# Altium schematic sheet PUMA-10S_V2.1.SchDoc: PUMA 10s (part 1 of 2)
size A0; Address2: PUMA technlogies; Address3: Tomsk; Address4: Russia; Revision: 2; PageSetup: Record=PageOptions|CenterHorizontal=True|CenterVertical=True|PrintScale=0.26|XCorrection=1.00|YCorrection=1.00|PrintKind=1|BorderSize=5000000|LeftOffset=0|BottomOffset=0|Orientation=2|PaperLength=8410|PaperWidth=11890|Scale=100|PaperSource=7|PrintQuality=720|MediaType=1|DitherType=10|PrintScaleMode=1|PaperKind=Custom Size|PaperIndex=256; ProjectName: PUMA 10s
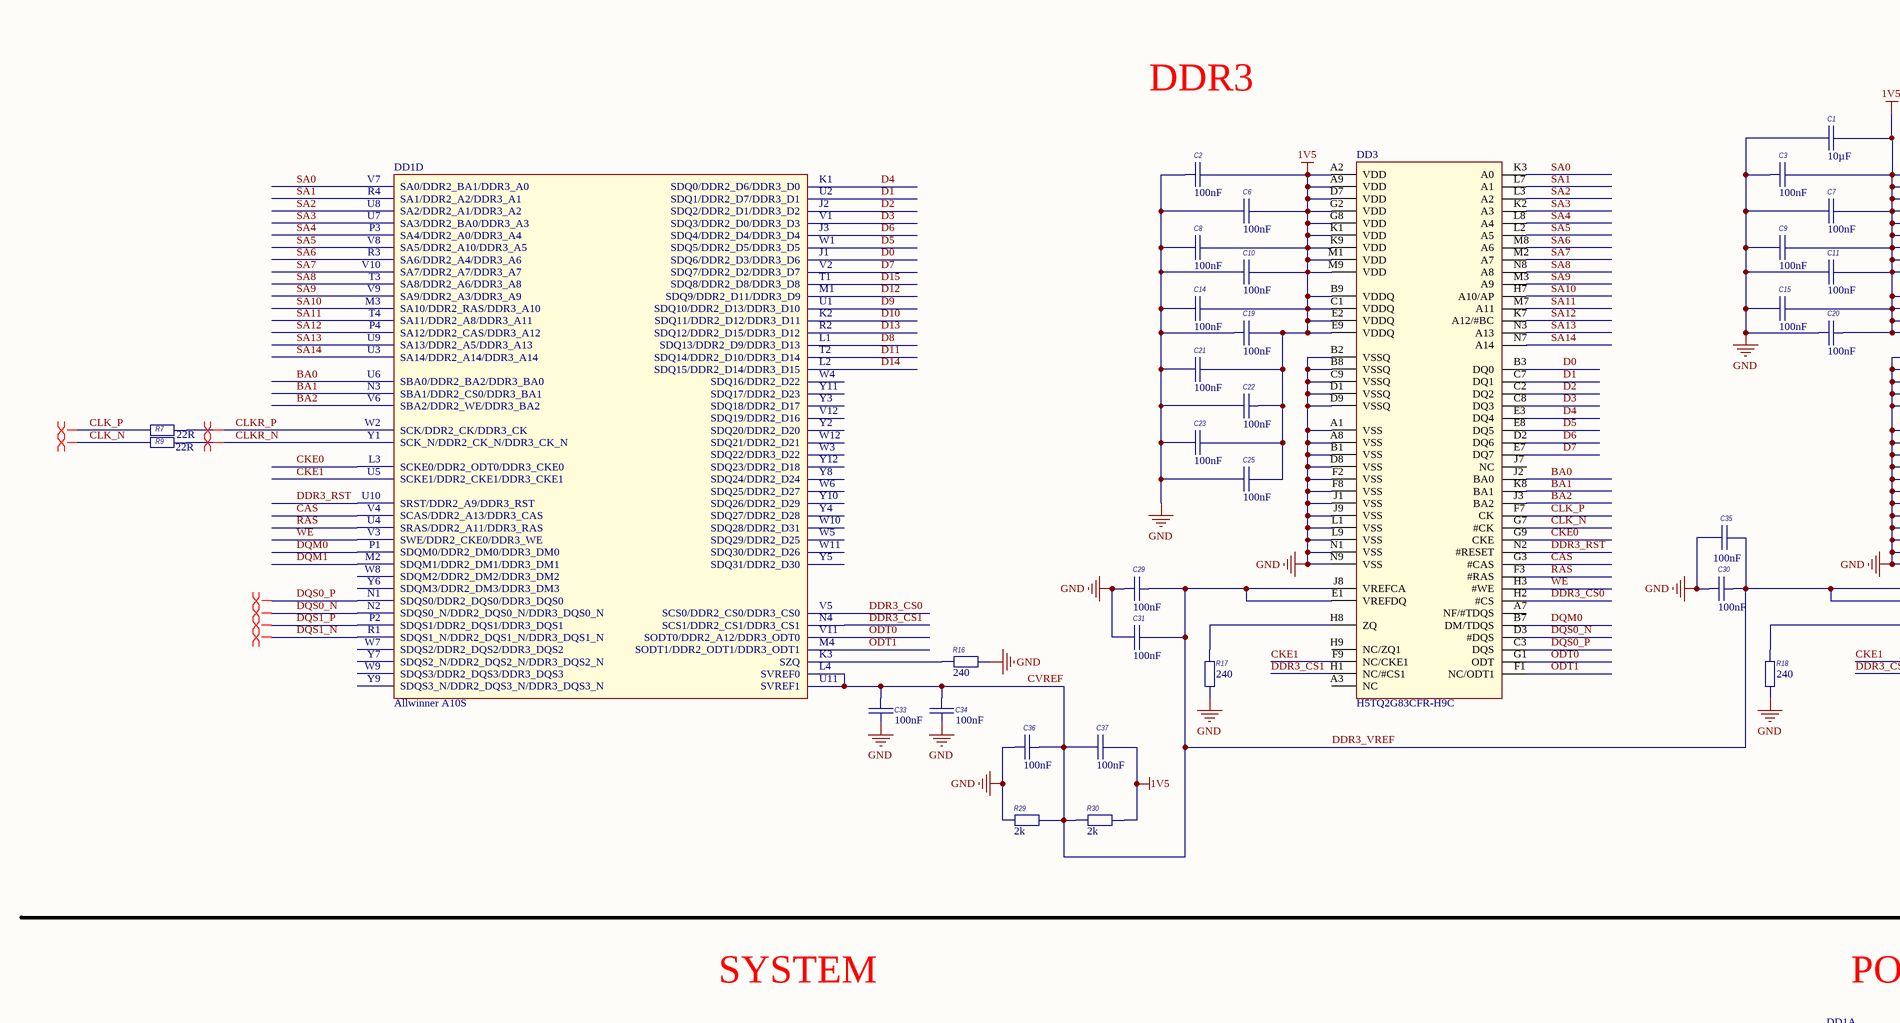
[diagram p0: PUMA-10S_V2.1.SchDoc, top left]
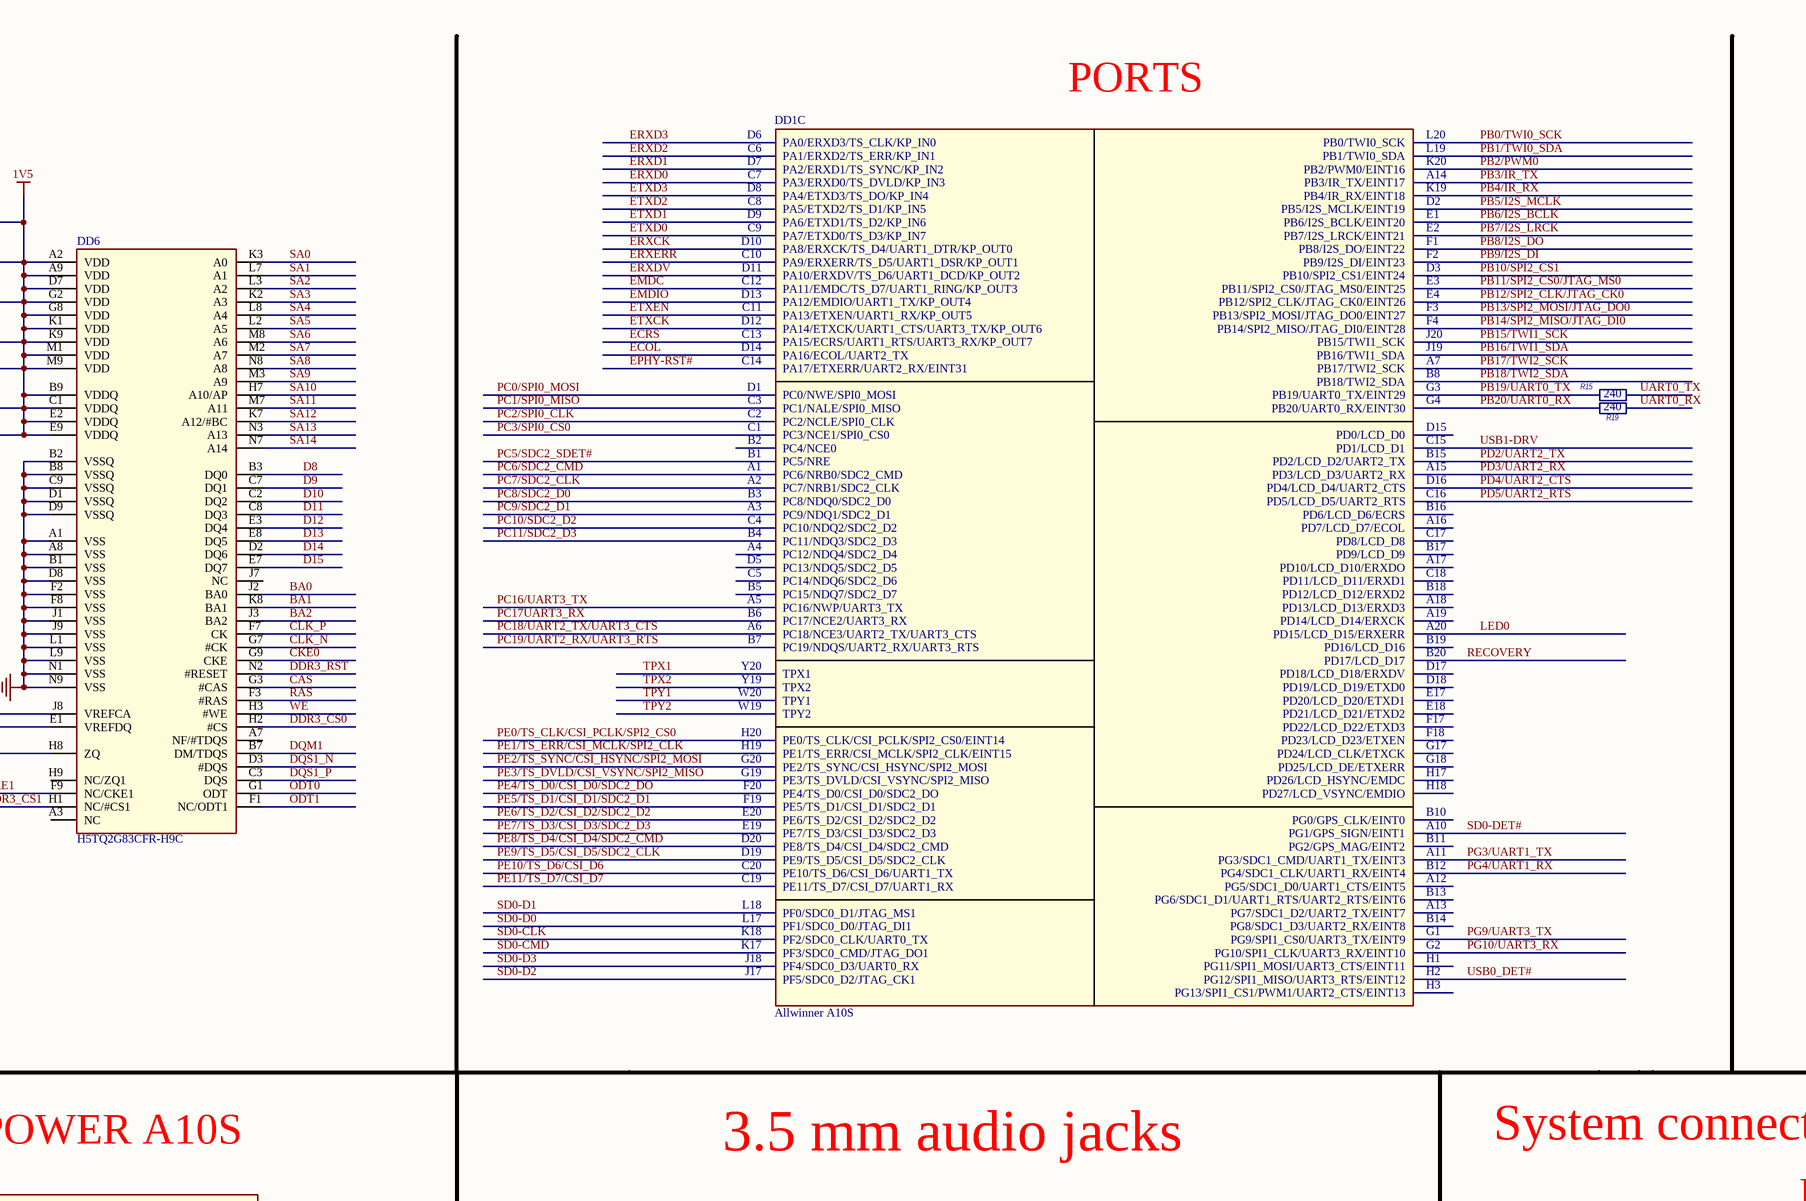
[diagram p1: PUMA-10S_V2.1.SchDoc, top middle]
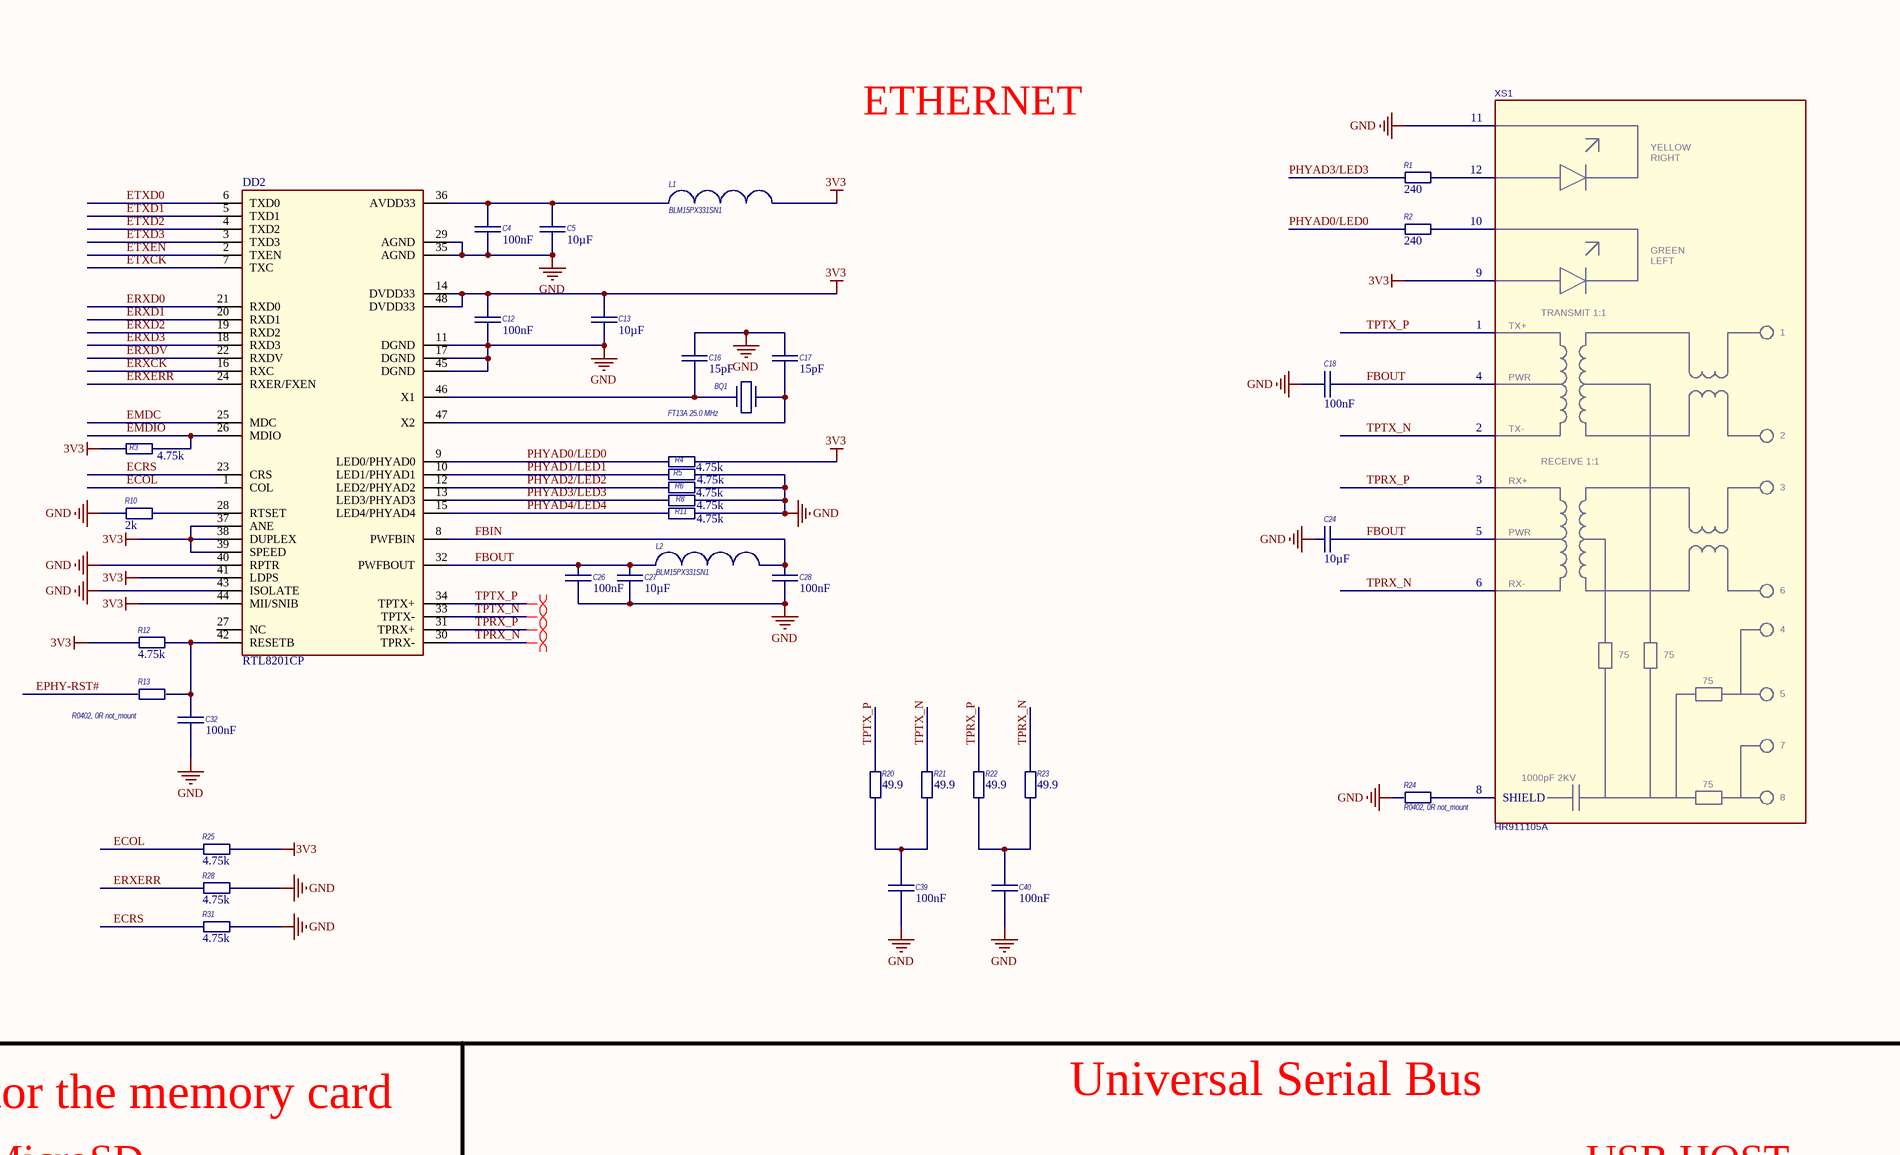
[diagram p2: PUMA-10S_V2.1.SchDoc, top right]
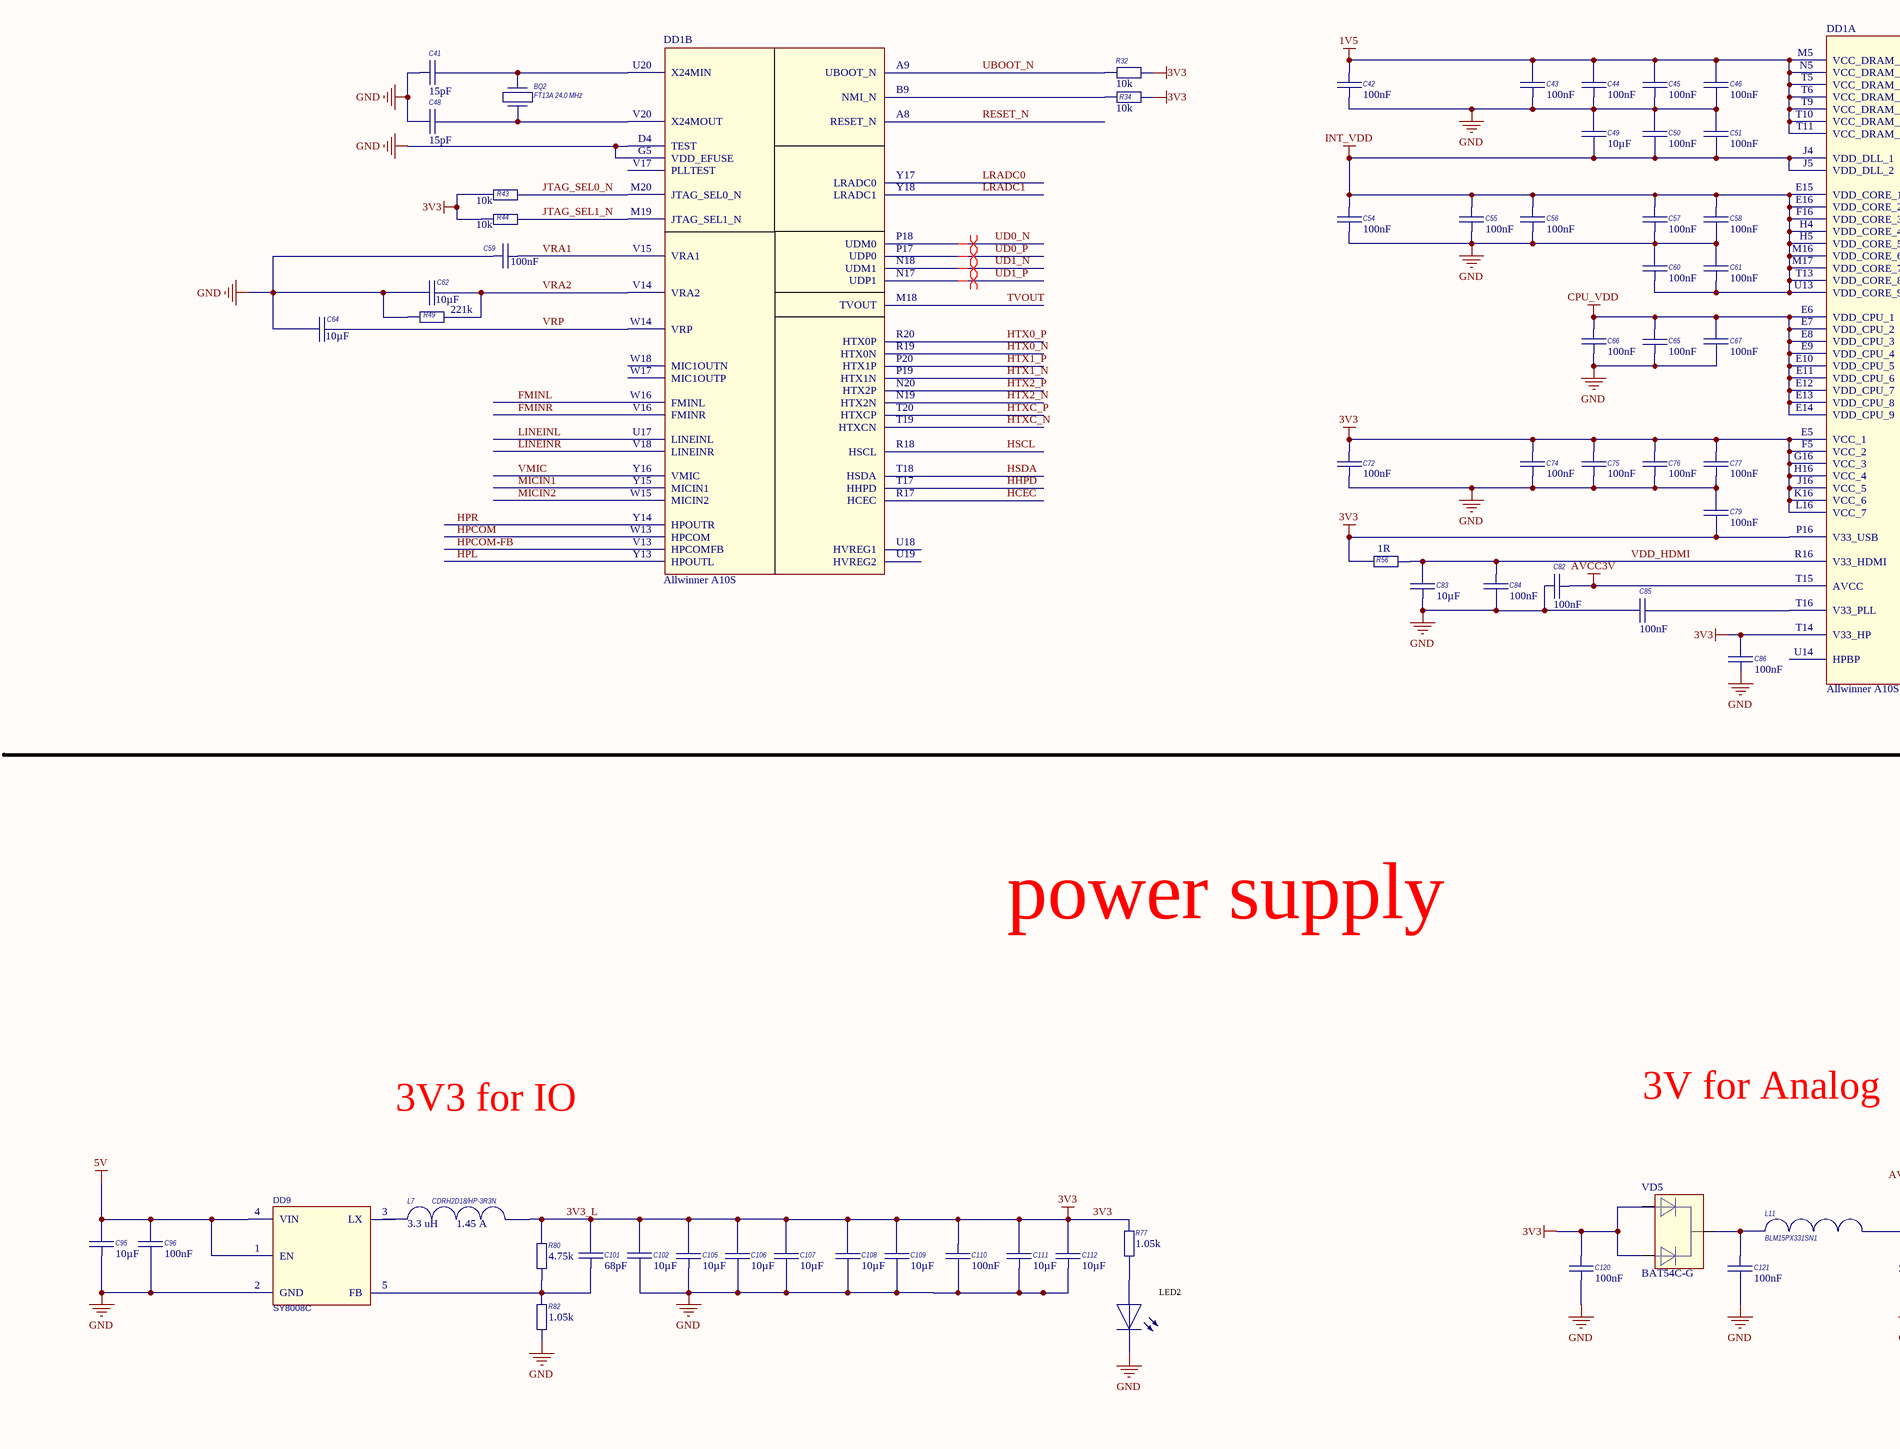
[diagram p3: PUMA-10S_V2.1.SchDoc, centre left]
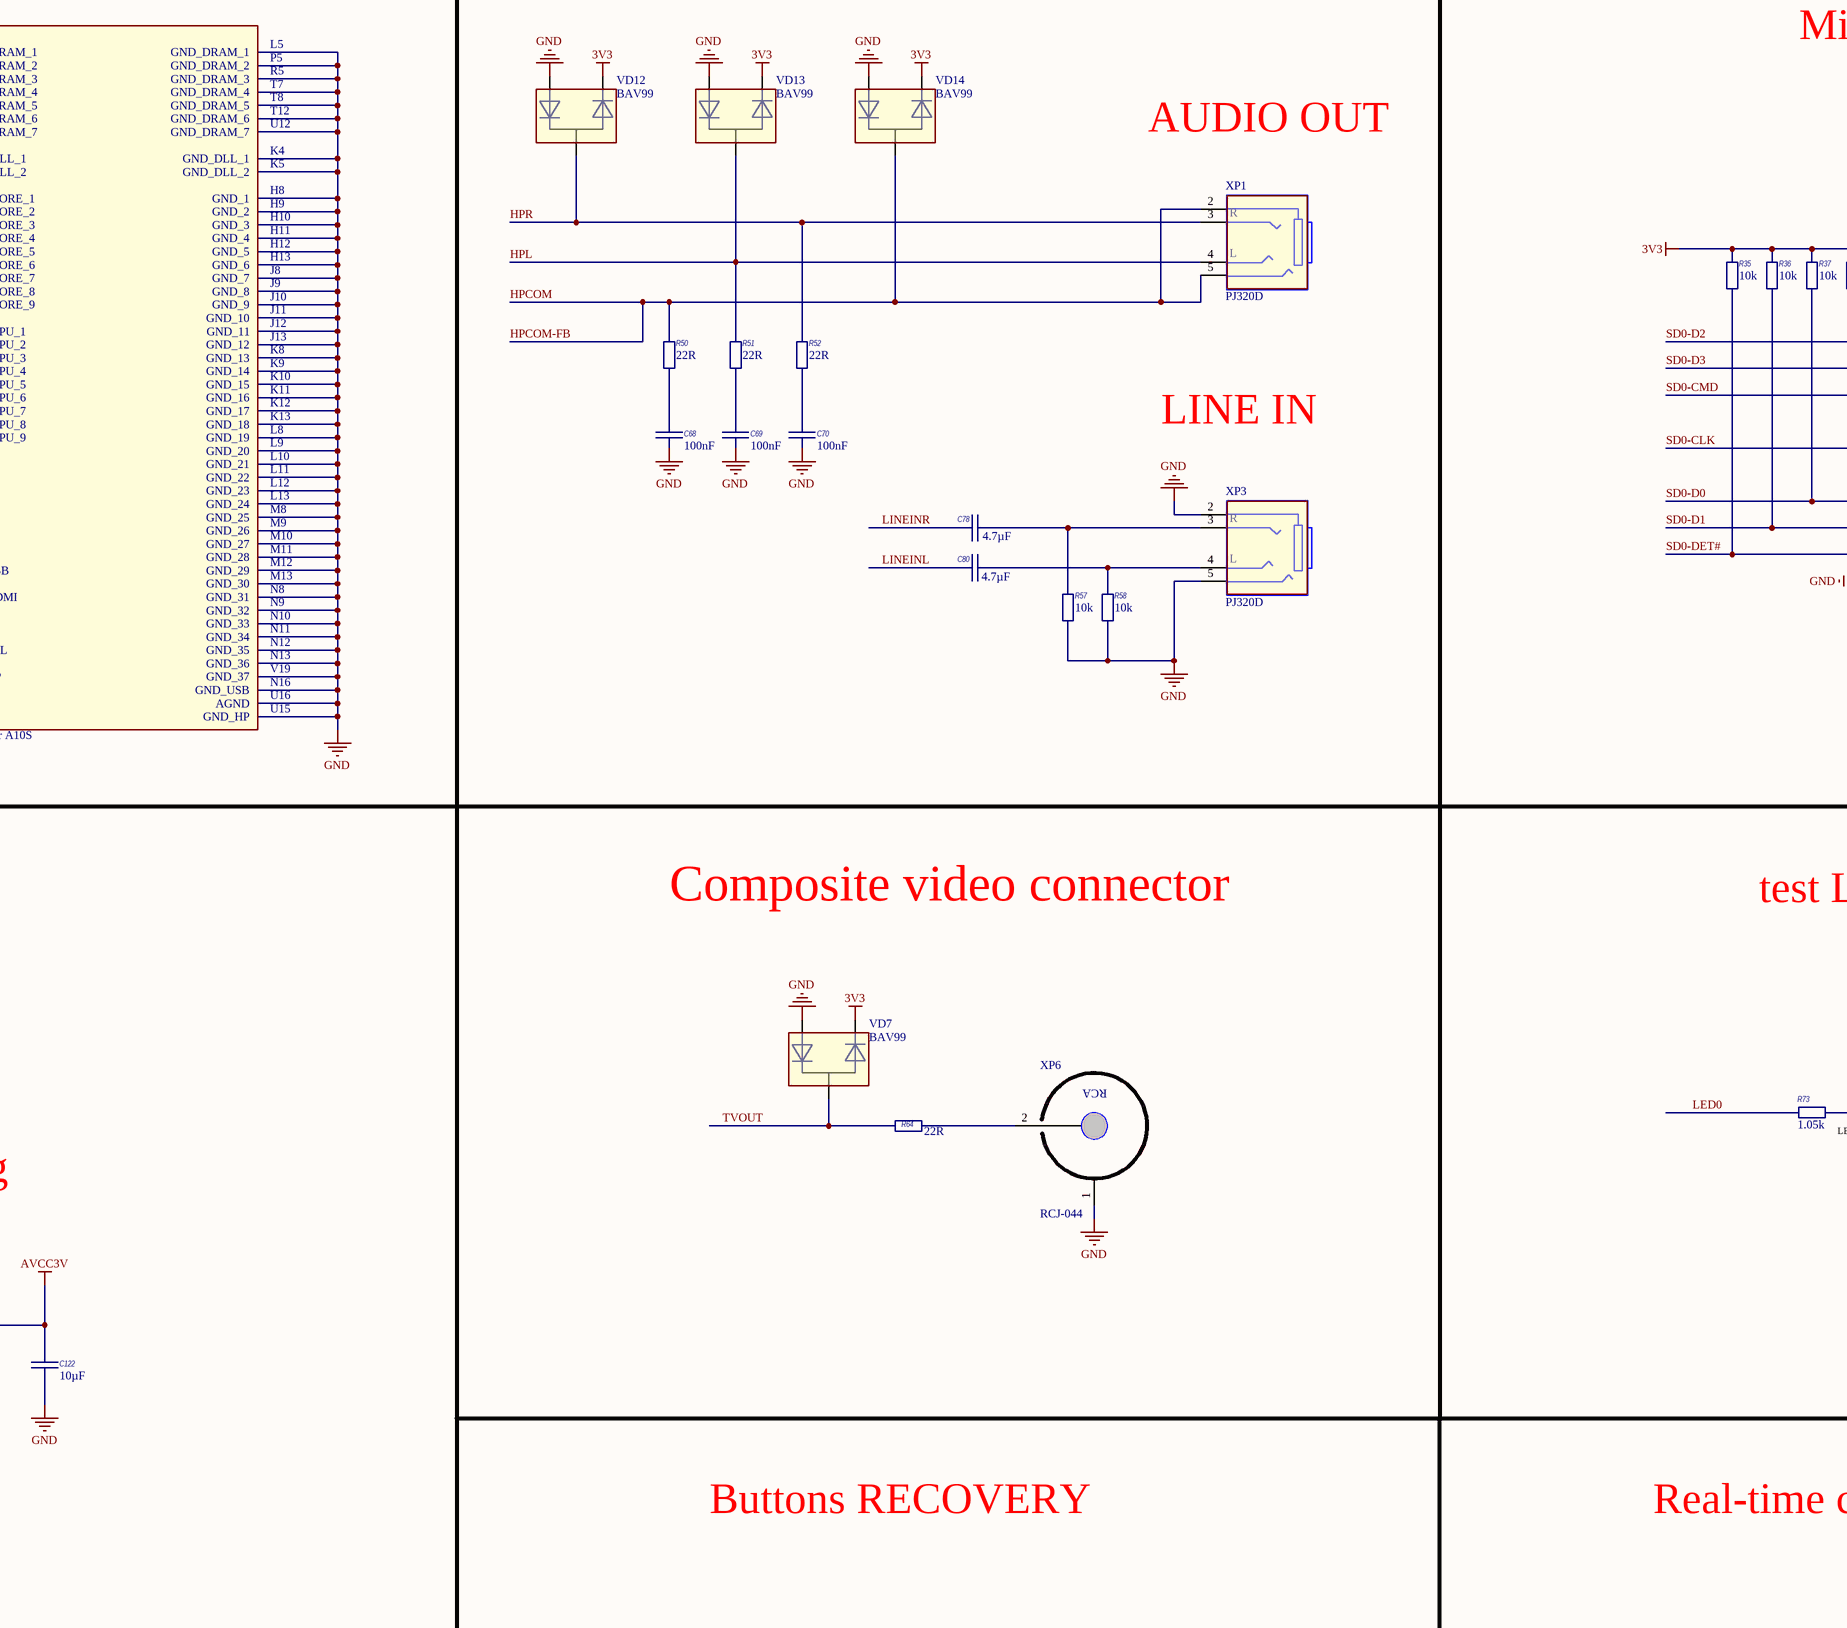
[diagram p4: PUMA-10S_V2.1.SchDoc, centre middle]
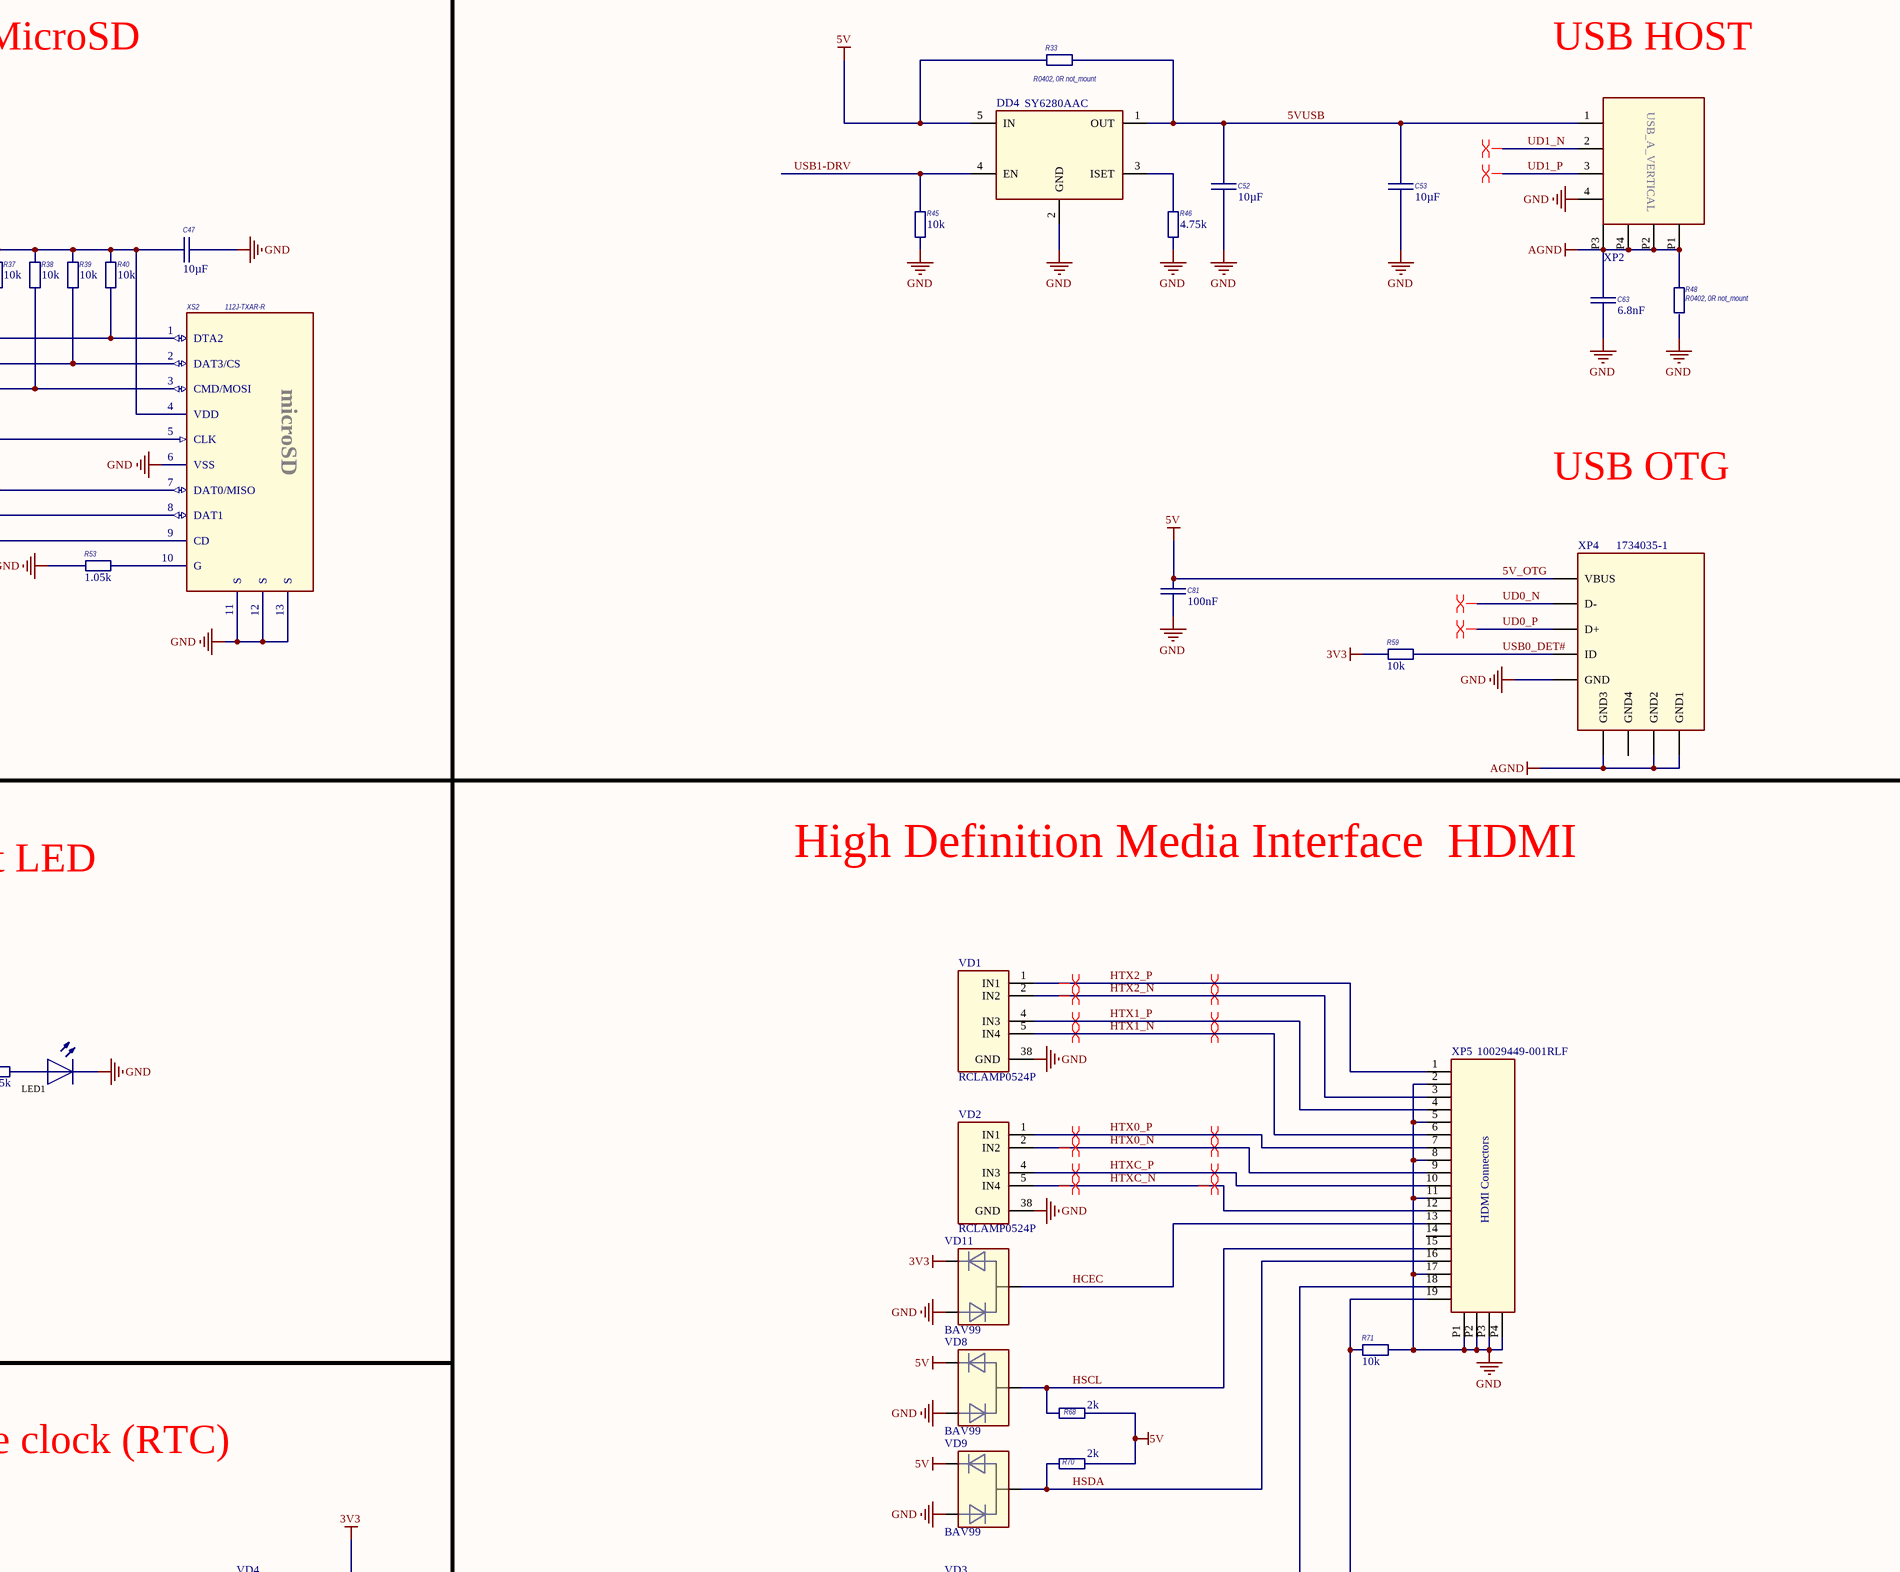
[diagram p5: PUMA-10S_V2.1.SchDoc, centre right]
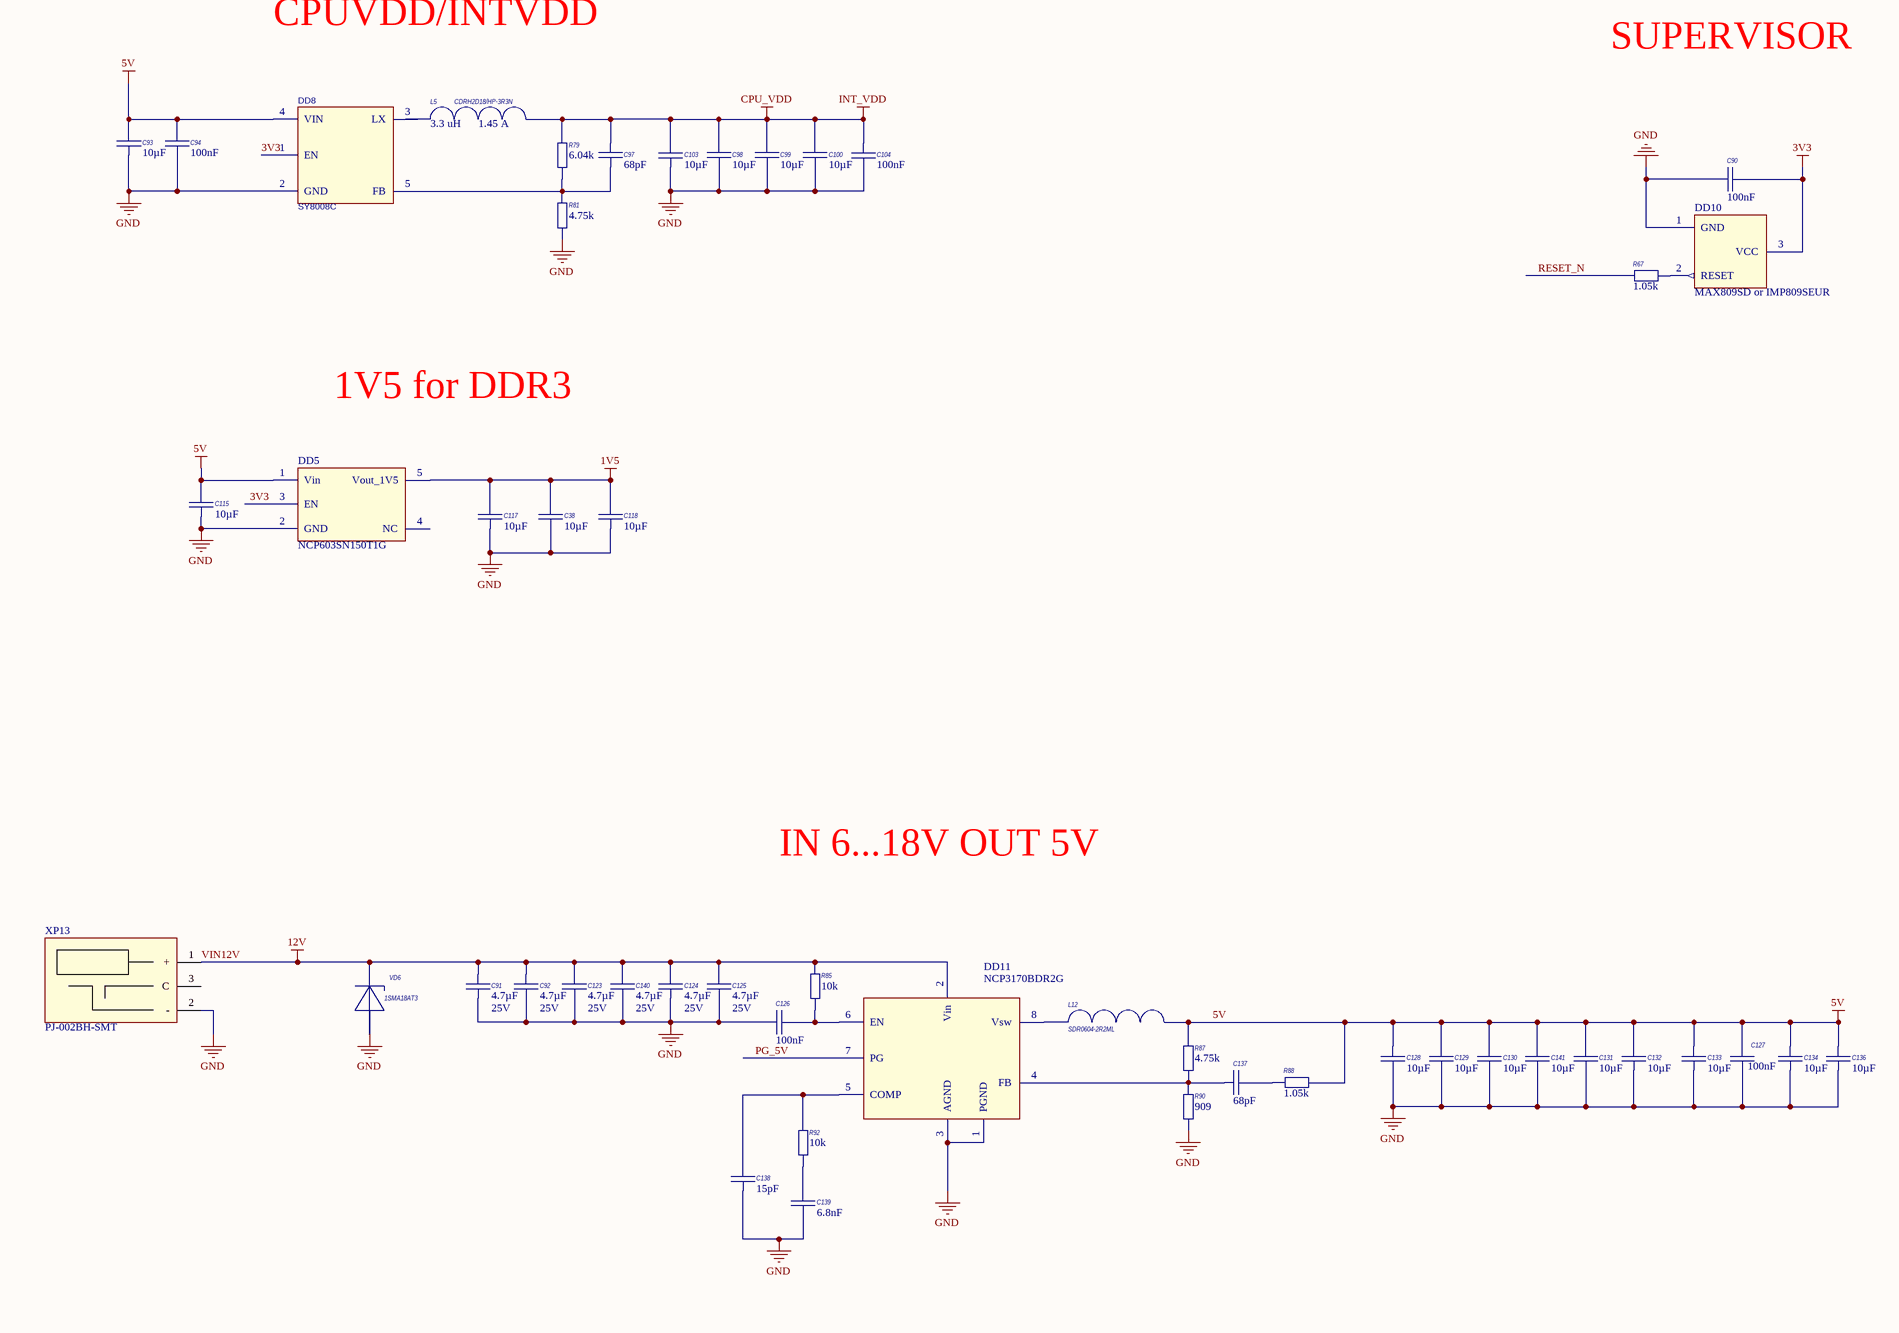
[diagram p6: PUMA-10S_V2.1.SchDoc, bottom left]
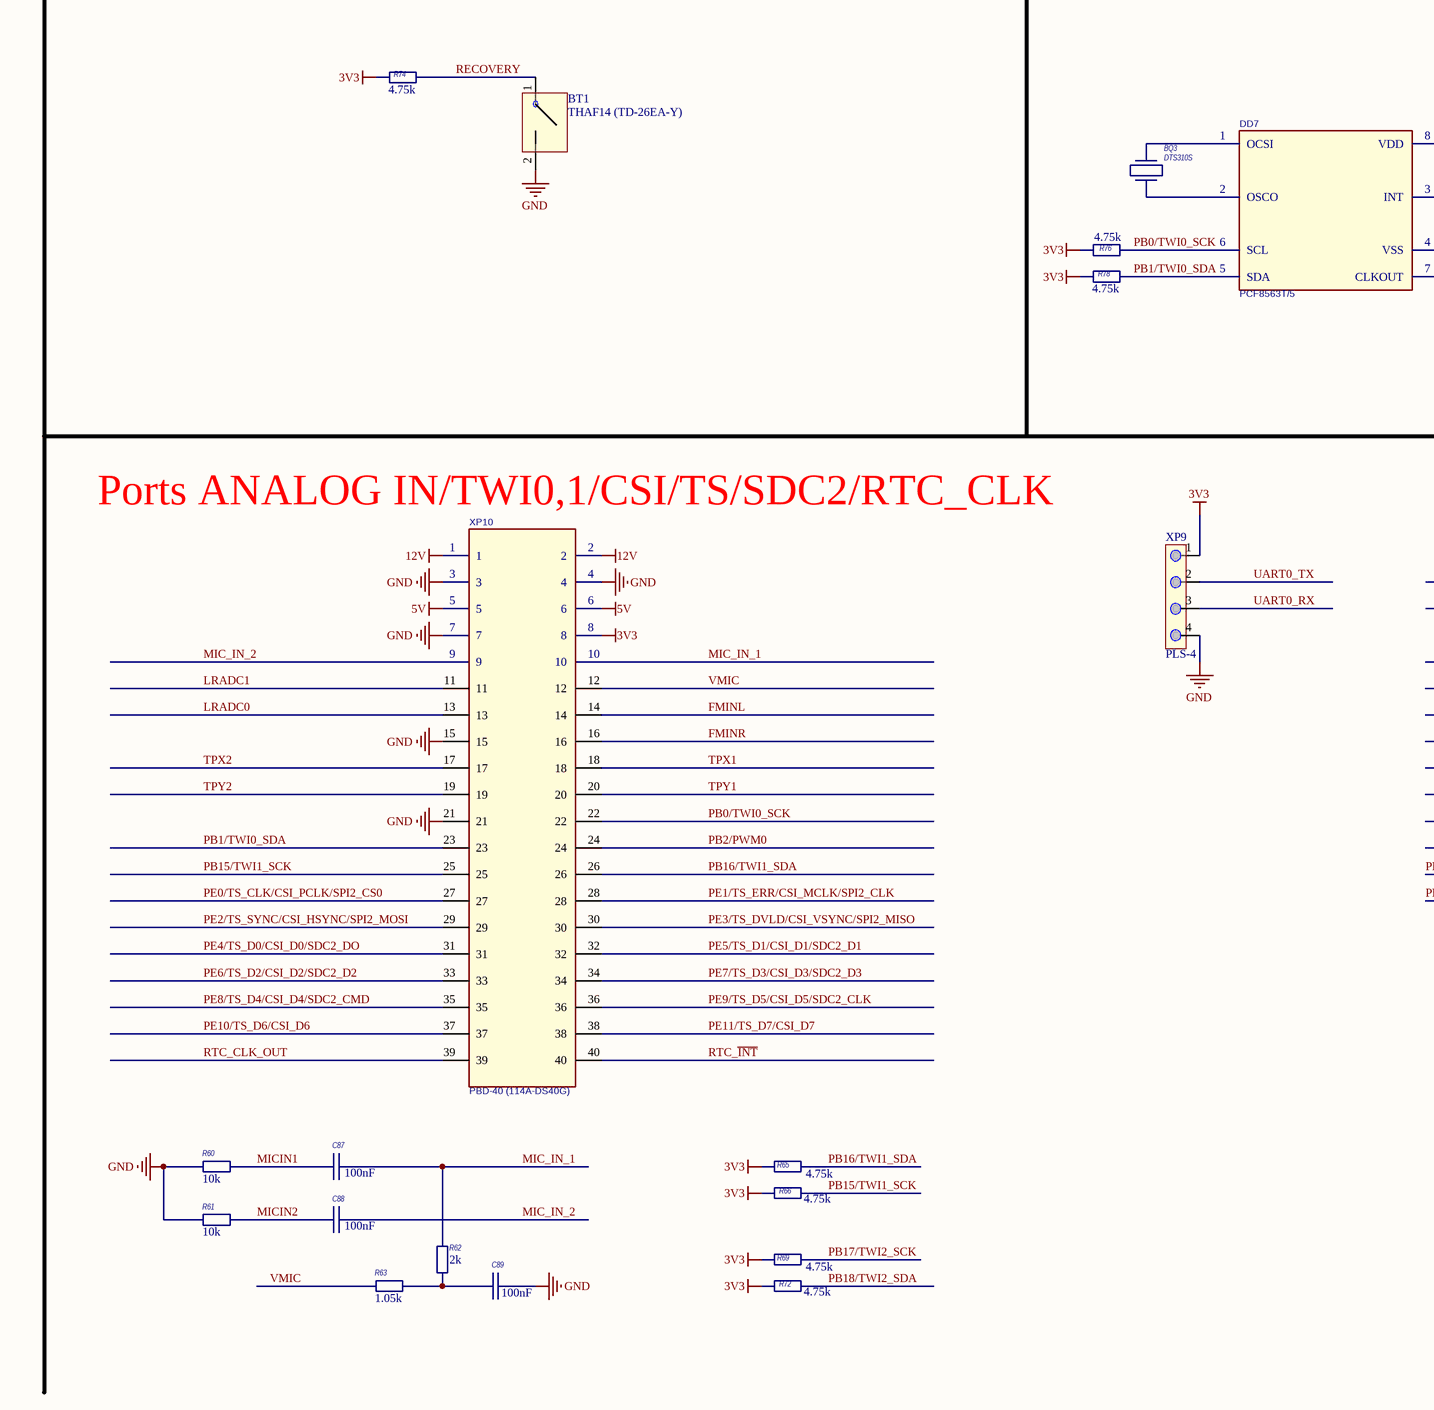
[diagram p7: PUMA-10S_V2.1.SchDoc, bottom middle]
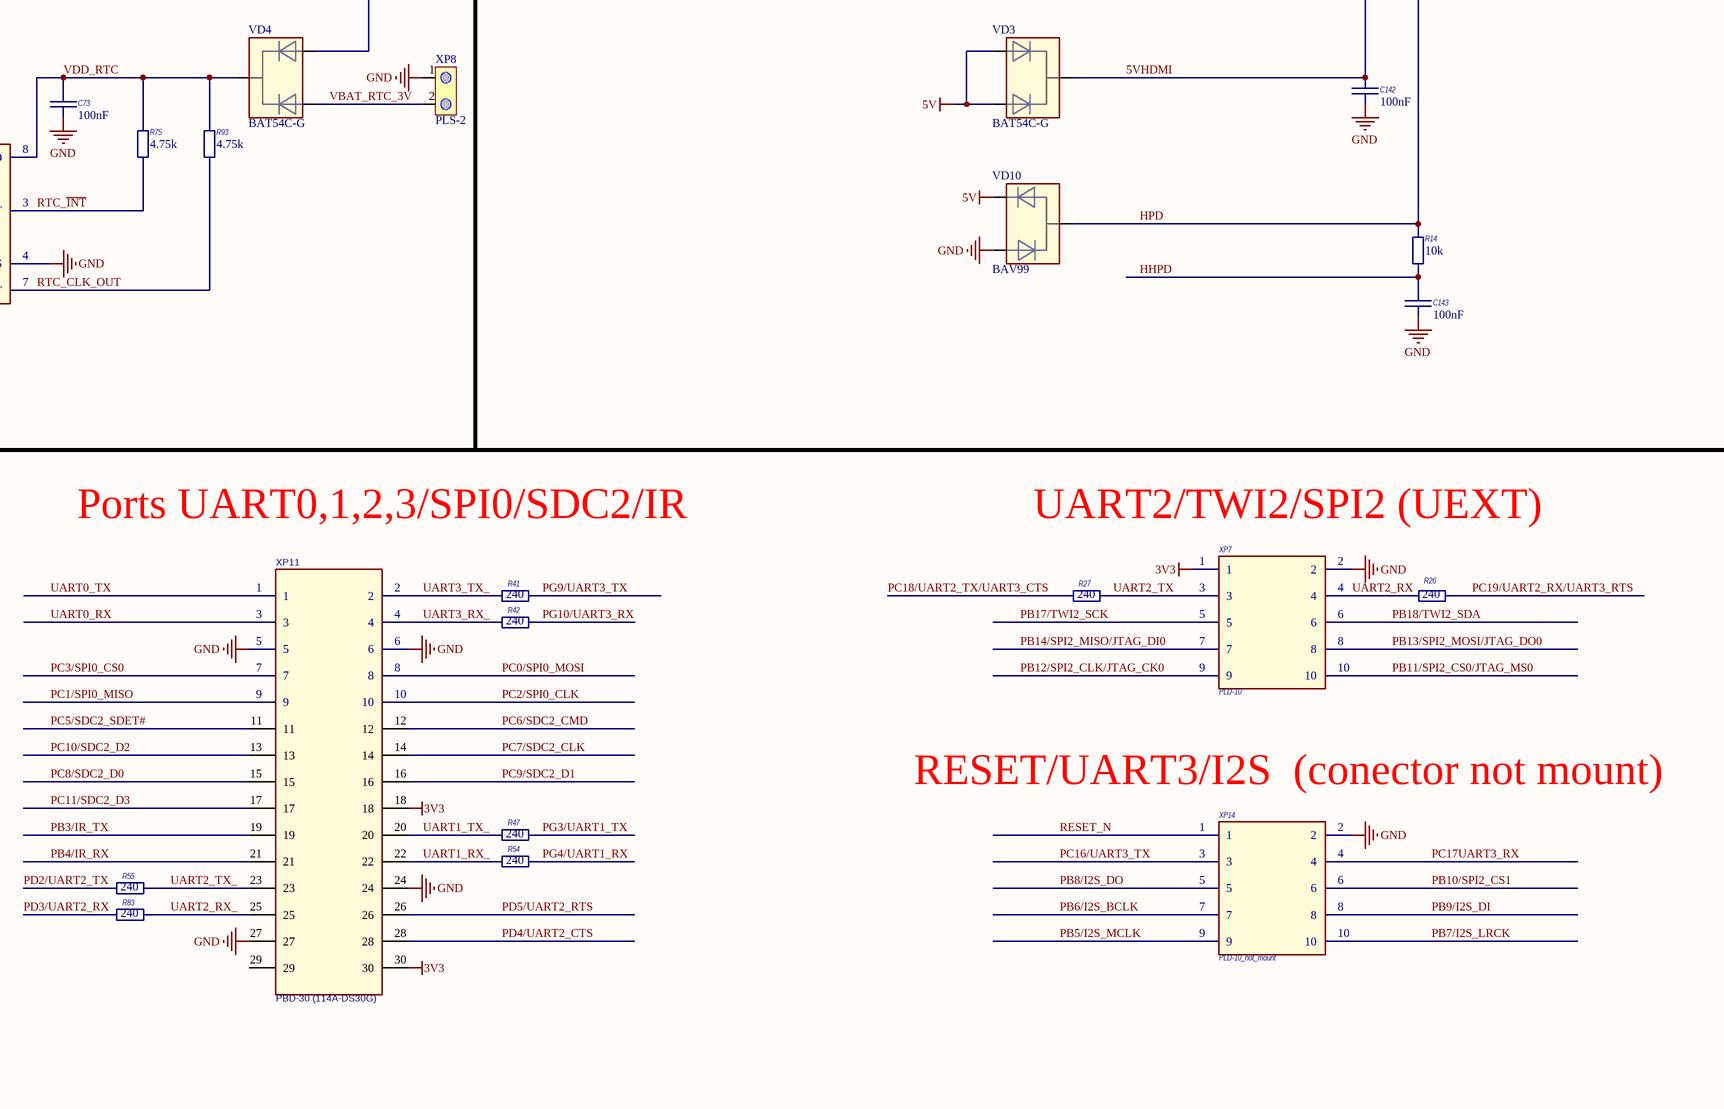
[diagram p8: PUMA-10S_V2.1.SchDoc, bottom right]

## Parts
BQ1  FT13A 25.0 MHz  [3225]
BQ2  FT13A 24.0 MHz  [3225]
BQ3  DTS310S  [3215]
BT1  THAF14 (TD-26EA-Y)  [THAF14]
C1  Capacitance: 10µF  [C0603]  (hidden comment: GRM188R60J106ME47)
C2  Capacitance: 100nF  [C0402_IPC High Density]  (hidden comment: GRM155R71C104KA88)
C3  Capacitance: 100nF  [C0402_IPC High Density]  (hidden comment: GRM155R71C104KA88)
C4  Capacitance: 100nF  [C0402_IPC High Density]  (hidden comment: GRM155R71C104KA88)
C5  Capacitance: 10µF  [C0603]  (hidden comment: GRM188R60J106ME47)
C6  Capacitance: 100nF  [C0402_IPC High Density]  (hidden comment: GRM155R71C104KA88)
C7  Capacitance: 100nF  [C0402_IPC High Density]  (hidden comment: GRM155R71C104KA88)
C8  Capacitance: 100nF  [C0402_IPC High Density]  (hidden comment: GRM155R71C104KA88)
C9  Capacitance: 100nF  [C0402_IPC High Density]  (hidden comment: GRM155R71C104KA88)
C10  Capacitance: 100nF  [C0402_IPC High Density]  (hidden comment: GRM155R71C104KA88)
C11  Capacitance: 100nF  [C0402_IPC High Density]  (hidden comment: GRM155R71C104KA88)
C12  Capacitance: 100nF  [C0402_IPC High Density]  (hidden comment: GRM155R71C104KA88)
C13  Capacitance: 10µF  [C0603]  (hidden comment: GRM188R60J106ME47)
C14  Capacitance: 100nF  [C0402_IPC High Density]  (hidden comment: GRM155R71C104KA88)
C15  Capacitance: 100nF  [C0402_IPC High Density]  (hidden comment: GRM155R71C104KA88)
C16  Capacitance: 15pF  [C0402_IPC High Density]  (hidden comment: GRM1555C1H150)
C17  Capacitance: 15pF  [C0402_IPC High Density]  (hidden comment: GRM1555C1H150)
C18  Capacitance: 100nF  [C0402_IPC High Density]  (hidden comment: GRM155R71C104KA88)
C19  Capacitance: 100nF  [C0402_IPC High Density]  (hidden comment: GRM155R71C104KA88)
C20  Capacitance: 100nF  [C0402_IPC High Density]  (hidden comment: GRM155R71C104KA88)
C21  Capacitance: 100nF  [C0402_IPC High Density]  (hidden comment: GRM155R71C104KA88)
C22  Capacitance: 100nF  [C0402_IPC High Density]  (hidden comment: GRM155R71C104KA88)
C23  Capacitance: 100nF  [C0402_IPC High Density]  (hidden comment: GRM155R71C104KA88)
C24  Capacitance: 10µF  [C0603]  (hidden comment: GRM188R60J106ME47)
C25  Capacitance: 100nF  [C0402_IPC High Density]  (hidden comment: GRM155R71C104KA88)
C26  Capacitance: 100nF  [C0402_IPC High Density]  (hidden comment: GRM155R71C104KA88)
C27  Capacitance: 10µF  [C0603]  (hidden comment: GRM188R60J106ME47)
C28  Capacitance: 100nF  [C0402_IPC High Density]  (hidden comment: GRM155R71C104KA88)
C29  Capacitance: 100nF  [C0402_IPC High Density]  (hidden comment: GRM155R71C104KA88)
C30  Capacitance: 100nF  [C0402_IPC High Density]  (hidden comment: GRM155R71C104KA88)
C31  Capacitance: 100nF  [C0402_IPC High Density]  (hidden comment: GRM155R71C104KA88)
C32  Capacitance: 100nF  [C0402_IPC High Density]  (hidden comment: GRM155R71C104KA88)
C33  Capacitance: 100nF  [C0402_IPC High Density]  (hidden comment: GRM155R71C104KA88)
C34  Capacitance: 100nF  [C0402_IPC High Density]  (hidden comment: GRM155R71C104KA88)
C35  Capacitance: 100nF  [C0402_IPC High Density]  (hidden comment: GRM155R71C104KA88)
C36  Capacitance: 100nF  [C0402_IPC High Density]  (hidden comment: GRM155R71C104KA88)
C37  Capacitance: 100nF  [C0402_IPC High Density]  (hidden comment: GRM155R71C104KA88)
C38  Capacitance: 10µF  [C0603]  (hidden comment: GRM188R60J106ME47)
C39  Capacitance: 100nF  [C0402_IPC High Density]  (hidden comment: GRM155R71C104KA88)
C40  Capacitance: 100nF  [C0402_IPC High Density]  (hidden comment: GRM155R71C104KA88)
C41  Capacitance: 15pF  [C0402_IPC High Density]  (hidden comment: GRM1555C1H150)
C42  Capacitance: 100nF  [C0402_IPC High Density]  (hidden comment: GRM155R71C104KA88)
C43  Capacitance: 100nF  [C0402_IPC High Density]  (hidden comment: GRM155R71C104KA88)
C44  Capacitance: 100nF  [C0402_IPC High Density]  (hidden comment: GRM155R71C104KA88)
C45  Capacitance: 100nF  [C0402_IPC High Density]  (hidden comment: GRM155R71C104KA88)
C46  Capacitance: 100nF  [C0402_IPC High Density]  (hidden comment: GRM155R71C104KA88)
C47  Capacitance: 10µF  [C0603]  (hidden comment: GRM188R60J106ME47)
C48  Capacitance: 15pF  [C0402_IPC High Density]  (hidden comment: GRM1555C1H150)
C49  Capacitance: 10µF  [C0603]  (hidden comment: GRM188R60J106ME47)
C50  Capacitance: 100nF  [C0402_IPC High Density]  (hidden comment: GRM155R71C104KA88)
C51  Capacitance: 100nF  [C0402_IPC High Density]  (hidden comment: GRM155R71C104KA88)
C52  Capacitance: 10µF  [C0603]  (hidden comment: GRM188R60J106ME47)
C53  Capacitance: 10µF  [C0603]  (hidden comment: GRM188R60J106ME47)
C54  Capacitance: 100nF  [C0402_IPC High Density]  (hidden comment: GRM155R71C104KA88)
C55  Capacitance: 100nF  [C0402_IPC High Density]  (hidden comment: GRM155R71C104KA88)
C56  Capacitance: 100nF  [C0402_IPC High Density]  (hidden comment: GRM155R71C104KA88)
C57  Capacitance: 100nF  [C0402_IPC High Density]  (hidden comment: GRM155R71C104KA88)
C58  Capacitance: 100nF  [C0402_IPC High Density]  (hidden comment: GRM155R71C104KA88)
C59  Capacitance: 100nF  [C0402_IPC High Density]  (hidden comment: GRM155R71C104KA88)
C60  Capacitance: 100nF  [C0402_IPC High Density]  (hidden comment: GRM155R71C104KA88)
C61  Capacitance: 100nF  [C0402_IPC High Density]  (hidden comment: GRM155R71C104KA88)
C62  Capacitance: 10µF  [C0603]  (hidden comment: GRM188R60J106ME47)
C63  Capacitance: 6.8nF  [C0402_IPC High Density]  (hidden comment: GRM155R71E682KA01)
C64  Capacitance: 10µF  [C0603]  (hidden comment: GRM188R60J106ME47)
C65  Capacitance: 100nF  [C0402_IPC High Density]  (hidden comment: GRM155R71C104KA88)
C66  Capacitance: 100nF  [C0402_IPC High Density]  (hidden comment: GRM155R71C104KA88)
C67  Capacitance: 100nF  [C0402_IPC High Density]  (hidden comment: GRM155R71C104KA88)
C68  Capacitance: 100nF  [C0402_IPC High Density]  (hidden comment: GRM155R71C104KA88)
C69  Capacitance: 100nF  [C0402_IPC High Density]  (hidden comment: GRM155R71C104KA88)
C70  Capacitance: 100nF  [C0402_IPC High Density]  (hidden comment: GRM155R71C104KA88)
C72  Capacitance: 100nF  [C0402_IPC High Density]  (hidden comment: GRM155R71C104KA88)
C73  Capacitance: 100nF  [C0402_IPC High Density]  (hidden comment: GRM155R71C104KA88)
C74  Capacitance: 100nF  [C0402_IPC High Density]  (hidden comment: GRM155R71C104KA88)
C75  Capacitance: 100nF  [C0402_IPC High Density]  (hidden comment: GRM155R71C104KA88)
C76  Capacitance: 100nF  [C0402_IPC High Density]  (hidden comment: GRM155R71C104KA88)
C77  Capacitance: 100nF  [C0402_IPC High Density]  (hidden comment: GRM155R71C104KA88)
C78  Capacitance: 4.7µF  [CAPC2012[0805]]  (hidden comment: GRM21BR61E475KA12)
C79  Capacitance: 100nF  [C0402_IPC High Density]  (hidden comment: GRM155R71C104KA88)
C80  Capacitance: 4.7µF  [CAPC2012[0805]]  (hidden comment: GRM21BR61E475KA12)
C81  Capacitance: 100nF  [C0402_IPC High Density]  (hidden comment: GRM155R71C104KA88)
C82  Capacitance: 100nF  [C0402_IPC High Density]  (hidden comment: GRM155R71C104KA88)
C83  Capacitance: 10µF  [C0603]  (hidden comment: GRM188R60J106ME47)
C84  Capacitance: 100nF  [C0402_IPC High Density]  (hidden comment: GRM155R71C104KA88)
C85  Capacitance: 100nF  [C0402_IPC High Density]  (hidden comment: GRM155R71C104KA88)
C86  Capacitance: 100nF  [C0402_IPC High Density]  (hidden comment: GRM155R71C104KA88)
C87  Capacitance: 100nF  [C0402_IPC High Density]  (hidden comment: GRM155R71C104KA88)
C88  Capacitance: 100nF  [C0402_IPC High Density]  (hidden comment: GRM155R71C104KA88)
C89  Capacitance: 100nF  [C0402_IPC High Density]  (hidden comment: GRM155R71C104KA88)
C90  Capacitance: 100nF  [C0402_IPC High Density]  (hidden comment: GRM155R71C104KA88)
C91  Capacitance: 4.7µF  Voltage - Rated: 25V  [CAPC2012[0805]]  (hidden comment: GRM21BR61E475KA12)
C92  Capacitance: 4.7µF  Voltage - Rated: 25V  [CAPC2012[0805]]  (hidden comment: GRM21BR61E475KA12)
C93  Capacitance: 10µF  [C0603]  (hidden comment: GRM188R60J106ME47)
C94  Capacitance: 100nF  [C0402_IPC High Density]  (hidden comment: GRM155R71C104KA88)
C95  Capacitance: 10µF  [C0603]  (hidden comment: GRM188R60J106ME47)
C96  Capacitance: 100nF  [C0402_IPC High Density]  (hidden comment: GRM155R71C104KA88)
C97  Capacitance: 68pF  [C0402_IPC High Density]  (hidden comment: GRM1555C1H680JZ01)
C98  Capacitance: 10µF  [C0603]  (hidden comment: GRM188R60J106ME47)
C99  Capacitance: 10µF  [C0603]  (hidden comment: GRM188R60J106ME47)
C100  Capacitance: 10µF  [C0603]  (hidden comment: GRM188R60J106ME47)
C101  Capacitance: 68pF  [C0402_IPC High Density]  (hidden comment: GRM1555C1H680JZ01)
C102  Capacitance: 10µF  [C0603]  (hidden comment: GRM188R60J106ME47)
C103  Capacitance: 10µF  [C0603]  (hidden comment: GRM188R60J106ME47)
C104  Capacitance: 100nF  [C0402_IPC High Density]  (hidden comment: GRM155R71C104KA88)
C105  Capacitance: 10µF  [C0603]  (hidden comment: GRM188R60J106ME47)
C106  Capacitance: 10µF  [C0603]  (hidden comment: GRM188R60J106ME47)
C107  Capacitance: 10µF  [C0603]  (hidden comment: GRM188R60J106ME47)
C108  Capacitance: 10µF  [C0603]  (hidden comment: GRM188R60J106ME47)
C109  Capacitance: 10µF  [C0603]  (hidden comment: GRM188R60J106ME47)
C110  Capacitance: 100nF  [C0402_IPC High Density]  (hidden comment: GRM155R71C104KA88)
C111  Capacitance: 10µF  [C0603]  (hidden comment: GRM188R60J106ME47)
C112  Capacitance: 10µF  [C0603]  (hidden comment: GRM188R60J106ME47)
C115  Capacitance: 10µF  [C0603]  (hidden comment: GRM188R60J106ME47)
C117  Capacitance: 10µF  [C0603]  (hidden comment: GRM188R60J106ME47)
C118  Capacitance: 10µF  [C0603]  (hidden comment: GRM188R60J106ME47)
C120  Capacitance: 100nF  [C0402_IPC High Density]  (hidden comment: GRM155R71C104KA88)
C121  Capacitance: 100nF  [C0402_IPC High Density]  (hidden comment: GRM155R71C104KA88)
C122  Capacitance: 10µF  [C0603]  (hidden comment: GRM188R60J106ME47)
C123  Capacitance: 4.7µF  Voltage - Rated: 25V  [CAPC2012[0805]]  (hidden comment: GRM21BR61E475KA12)
C124  Capacitance: 4.7µF  Voltage - Rated: 25V  [CAPC2012[0805]]  (hidden comment: GRM21BR61E475KA12)
C125  Capacitance: 4.7µF  Voltage - Rated: 25V  [CAPC2012[0805]]  (hidden comment: GRM21BR61E475KA12)
C126  Capacitance: 100nF  [C0402_IPC High Density]  (hidden comment: GRM155R71C104KA88)
C127  Capacitance: 100nF  [C0402_IPC High Density]  (hidden comment: GRM155R71C104KA88)
C128  Capacitance: 10µF  [C0603]  (hidden comment: GRM188R60J106ME47)
C129  Capacitance: 10µF  [C0603]  (hidden comment: GRM188R60J106ME47)
C130  Capacitance: 10µF  [C0603]  (hidden comment: GRM188R60J106ME47)
C131  Capacitance: 10µF  [C0603]  (hidden comment: GRM188R60J106ME47)
C132  Capacitance: 10µF  [C0603]  (hidden comment: GRM188R60J106ME47)
C133  Capacitance: 10µF  [C0603]  (hidden comment: GRM188R60J106ME47)
C134  Capacitance: 10µF  [C0603]  (hidden comment: GRM188R60J106ME47)
C136  Capacitance: 10µF  [C0603]  (hidden comment: GRM188R60J106ME47)
C137  Capacitance: 68pF  [C0402_IPC High Density]  (hidden comment: GRM1555C1H680JZ01)
C138  Capacitance: 15pF  [C0402_IPC High Density]  (hidden comment: GRM1555C1H150)
C139  Capacitance: 6.8nF  [C0402_IPC High Density]  (hidden comment: GRM155R71E682KA01)
C140  Capacitance: 4.7µF  Voltage - Rated: 25V  [CAPC2012[0805]]  (hidden comment: GRM21BR61E475KA12)
C141  Capacitance: 10µF  [C0603]  (hidden comment: GRM188R60J106ME47)
C142  Capacitance: 100nF  [C0402_IPC High Density]  (hidden comment: GRM155R71C104KA88)
C143  Capacitance: 100nF  [C0402_IPC High Density]  (hidden comment: GRM155R71C104KA88)
DD1  Allwinner A10S  [TFBGA336]  (parts A,B,C,D of 4)
DD2  RTL8201CP  [LQFP48]
DD3  H5TQ2G83CFR-H9C  [FBGA78]
DD4  SY6280AAC  [SOT23-5]
DD5  NCP603SN150T1G  [SOT23-5]
DD6  H5TQ2G83CFR-H9C  [FBGA78]
DD7  PCF8563T/5  [SO-8_L]
DD8  SY8008C  [SOT23-5]
DD9  SY8008C  [SOT23-5]
DD10  MAX809SD or IMP809SEUR  [SOT-23]
DD11  NCP3170BDR2G  [SO-8_N]
L1  BLM15PX331SN1  [L 0402]
L2  BLM15PX331SN1  [L 0402]
L5  CDRH2D18/HP-3R3N  Inductance: 3.3 uH  Maximum DC Current: 1.45 A  [CDRH2D18B/HPNP-3R3N]
L7  CDRH2D18/HP-3R3N  Inductance: 3.3 uH  Maximum DC Current: 1.45 A  [CDRH2D18B/HPNP-3R3N]
L11  BLM15PX331SN1  [L 0402]
L12  SDR0604-2R2ML  [SDR0403]
LED1  FYLS-0603PGC  [LED0603]  (value not drawn)
LED2  FYLS-0603PGC  [LED0603]  (value not drawn)
R1  Resistance (Ohms): 240  [RESC1005[0402]]  (hidden comment: ERJ-2RKF2400X)
R2  Resistance (Ohms): 240  [RESC1005[0402]]  (hidden comment: ERJ-2RKF2400X)
R3  Resistance (Ohms): 4.75k  [RESC1005[0402]]  (hidden comment: ERJ-2RKF4751X)
R4  Resistance (Ohms): 4.75k  [RESC1005[0402]]  (hidden comment: ERJ-2RKF4751X)
R5  Resistance (Ohms): 4.75k  [RESC1005[0402]]  (hidden comment: ERJ-2RKF4751X)
R6  Resistance (Ohms): 4.75k  [RESC1005[0402]]  (hidden comment: ERJ-2RKF4751X)
R7  Resistance: 22R  [RESC1005[0402]]  (hidden comment: ERJ-2RKF22R0X)
R8  Resistance (Ohms): 4.75k  [RESC1005[0402]]  (hidden comment: ERJ-2RKF4751X)
R9  Resistance: 22R  [RESC1005[0402]]  (hidden comment: ERJ-2RKF22R0X)
R10  Resistance (Ohms): 2k  [RESC1005[0402]]  (hidden comment: ERJ-2RKF2001X)
R11  Resistance (Ohms): 4.75k  [RESC1005[0402]]  (hidden comment: ERJ-2RKF4751X)
R12  Resistance (Ohms): 4.75k  [RESC1005[0402]]  (hidden comment: ERJ-2RKF4751X)
R13  CR0402-J/-000GLF not_mount  [RESC1005[0402]]  (value not drawn)
R14  Resistance: 10k  [RESC1005[0402]]  (hidden comment: ERJ-2RKF1002X)
R15  Resistance (Ohms): 240  [RESC1005[0402]]  (hidden comment: ERJ-2RKF2400X)
R16  Resistance (Ohms): 240  [RESC1005[0402]]  (hidden comment: ERJ-2RKF2400X)
R17  Resistance (Ohms): 240  [RESC1005[0402]]  (hidden comment: ERJ-2RKF2400X)
R18  Resistance (Ohms): 240  [RESC1005[0402]]  (hidden comment: ERJ-2RKF2400X)
R19  Resistance (Ohms): 240  [RESC1005[0402]]  (hidden comment: ERJ-2RKF2400X)
R20  Resistance: 49.9  [RESC1005[0402]]  (hidden comment: ERJ-2RKF49R9X)
R21  Resistance: 49.9  [RESC1005[0402]]  (hidden comment: ERJ-2RKF49R9X)
R22  Resistance: 49.9  [RESC1005[0402]]  (hidden comment: ERJ-2RKF49R9X)
R23  Resistance: 49.9  [RESC1005[0402]]  (hidden comment: ERJ-2RKF49R9X)
R24  CR0402-J/-000GLF not_mount  [RESC1005[0402]]  (value not drawn)
R25  Resistance (Ohms): 4.75k  [RESC1005[0402]]  (hidden comment: ERJ-2RKF4751X)
R26  Resistance (Ohms): 240  [RESC1005[0402]]  (hidden comment: ERJ-2RKF2400X)
R27  Resistance (Ohms): 240  [RESC1005[0402]]  (hidden comment: ERJ-2RKF2400X)
R28  Resistance (Ohms): 4.75k  [RESC1005[0402]]  (hidden comment: ERJ-2RKF4751X)
R29  Resistance (Ohms): 2k  [RESC1005[0402]]  (hidden comment: ERJ-2RKF2001X)
R30  Resistance (Ohms): 2k  [RESC1005[0402]]  (hidden comment: ERJ-2RKF2001X)
R31  Resistance (Ohms): 4.75k  [RESC1005[0402]]  (hidden comment: ERJ-2RKF4751X)
R32  Resistance: 10k  [RESC1005[0402]]  (hidden comment: ERJ-2RKF1002X)
R33  CR0402-J/-000GLF not_mount  [RESC1005[0402]]  (value not drawn)
R34  Resistance: 10k  [RESC1005[0402]]  (hidden comment: ERJ-2RKF1002X)
R35  Resistance: 10k  [RESC1005[0402]]  (hidden comment: ERJ-2RKF1002X)
R36  Resistance: 10k  [RESC1005[0402]]  (hidden comment: ERJ-2RKF1002X)
R37  Resistance: 10k  [RESC1005[0402]]  (hidden comment: ERJ-2RKF1002X)
R38  Resistance: 10k  [RESC1005[0402]]  (hidden comment: ERJ-2RKF1002X)
R39  Resistance: 10k  [RESC1005[0402]]  (hidden comment: ERJ-2RKF1002X)
R40  Resistance: 10k  [RESC1005[0402]]  (hidden comment: ERJ-2RKF1002X)
R41  Resistance (Ohms): 240  [RESC1005[0402]]  (hidden comment: ERJ-2RKF2400X)
R42  Resistance (Ohms): 240  [RESC1005[0402]]  (hidden comment: ERJ-2RKF2400X)
R43  Resistance: 10k  [RESC1005[0402]]  (hidden comment: ERJ-2RKF1002X)
R44  Resistance: 10k  [RESC1005[0402]]  (hidden comment: ERJ-2RKF1002X)
R45  Resistance: 10k  [RESC1005[0402]]  (hidden comment: ERJ-2RKF1002X)
R46  Resistance (Ohms): 4.75k  [RESC1005[0402]]  (hidden comment: ERJ-2RKF4751X)
R47  Resistance (Ohms): 240  [RESC1005[0402]]  (hidden comment: ERJ-2RKF2400X)
R48  CR0402-J/-000GLF not_mount  [RESC1005[0402]]  (value not drawn)
R49  Resistance (Ohms): 221k  [RESC1005[0402]]  (hidden comment: ERJ-2RKF2213X)
R50  Resistance: 22R  [RESC1005[0402]]  (hidden comment: ERJ-2RKF22R0X)
R51  Resistance: 22R  [RESC1005[0402]]  (hidden comment: ERJ-2RKF22R0X)
R52  Resistance: 22R  [RESC1005[0402]]  (hidden comment: ERJ-2RKF22R0X)
R53  Resistance: 1.05k  [RESC1005[0402]]  (hidden comment: ERJ-2RKF1051X)
R54  Resistance (Ohms): 240  [RESC1005[0402]]  (hidden comment: ERJ-2RKF2400X)
R55  Resistance (Ohms): 240  [RESC1005[0402]]  (hidden comment: ERJ-2RKF2400X)
R56  Resistance (Ohms): 1R  [RESC1005[0402]]  (hidden comment: ERJ-2GEJ1R0X)
R57  Resistance: 10k  [RESC1005[0402]]  (hidden comment: ERJ-2RKF1002X)
R58  Resistance: 10k  [RESC1005[0402]]  (hidden comment: ERJ-2RKF1002X)
R59  Resistance: 10k  [RESC1005[0402]]  (hidden comment: ERJ-2RKF1002X)
R60  Resistance: 10k  [RESC1005[0402]]  (hidden comment: ERJ-2RKF1002X)
R61  Resistance: 10k  [RESC1005[0402]]  (hidden comment: ERJ-2RKF1002X)
R62  Resistance (Ohms): 2k  [RESC1005[0402]]  (hidden comment: ERJ-2RKF2001X)
R63  Resistance: 1.05k  [RESC1005[0402]]  (hidden comment: ERJ-2RKF1051X)
R64  Resistance: 22R  [RESC1005[0402]]  (hidden comment: ERJ-2RKF22R0X)
R65  Resistance (Ohms): 4.75k  [RESC1005[0402]]  (hidden comment: ERJ-2RKF4751X)
R66  Resistance (Ohms): 4.75k  [RESC1005[0402]]  (hidden comment: ERJ-2RKF4751X)
R67  Resistance: 1.05k  [RESC1005[0402]]  (hidden comment: ERJ-2RKF1051X)
R68  Resistance (Ohms): 2k  [RESC1005[0402]]  (hidden comment: ERJ-2RKF2001X)
R69  Resistance (Ohms): 4.75k  [RESC1005[0402]]  (hidden comment: ERJ-2RKF4751X)
R70  Resistance (Ohms): 2k  [RESC1005[0402]]  (hidden comment: ERJ-2RKF2001X)
R71  Resistance: 10k  [RESC1005[0402]]  (hidden comment: ERJ-2RKF1002X)
R72  Resistance (Ohms): 4.75k  [RESC1005[0402]]  (hidden comment: ERJ-2RKF4751X)
R73  Resistance: 1.05k  [RESC1005[0402]]  (hidden comment: ERJ-2RKF1051X)
R74  Resistance (Ohms): 4.75k  [RESC1005[0402]]  (hidden comment: ERJ-2RKF4751X)
R75  Resistance (Ohms): 4.75k  [RESC1005[0402]]  (hidden comment: ERJ-2RKF4751X)
R76  Resistance (Ohms): 4.75k  [RESC1005[0402]]  (hidden comment: ERJ-2RKF4751X)
R77  Resistance: 1.05k  [RESC1005[0402]]  (hidden comment: ERJ-2RKF1051X)
R78  Resistance (Ohms): 4.75k  [RESC1005[0402]]  (hidden comment: ERJ-2RKF4751X)
R79  Resistance (Ohms): 6.04k  [RESC1005[0402]]  (hidden comment: ERJ-2RKF6041X)
R80  Resistance (Ohms): 4.75k  [RESC1005[0402]]  (hidden comment: ERJ-2RKF4751X)
R81  Resistance (Ohms): 4.75k  [RESC1005[0402]]  (hidden comment: ERJ-2RKF4751X)
R82  Resistance: 1.05k  [RESC1005[0402]]  (hidden comment: ERJ-2RKF1051X)
R83  Resistance (Ohms): 240  [RESC1005[0402]]  (hidden comment: ERJ-2RKF2400X)
R85  Resistance: 10k  [RESC1005[0402]]  (hidden comment: ERJ-2RKF1002X)
R87  Resistance (Ohms): 4.75k  [RESC1005[0402]]  (hidden comment: ERJ-2RKF4751X)
R88  Resistance: 1.05k  [RESC1005[0402]]  (hidden comment: ERJ-2RKF1051X)
R90  Resistance: 909  [RESC1005[0402]]  (hidden comment: ERJ-2RKF9090X)
R92  Resistance: 10k  [RESC1005[0402]]  (hidden comment: ERJ-2RKF1002X)
R93  Resistance (Ohms): 4.75k  [RESC1005[0402]]  (hidden comment: ERJ-2RKF4751X)
VD1  RCLAMP0524P  [SLP2510P8]
VD2  RCLAMP0524P  [SLP2510P8]
VD3  BAT54C-G  [SOT-23]
VD4  BAT54C-G  [SOT-23]
VD5  BAT54C-G  [SOT-23]
VD6  1SMA18AT3  [SMA]
VD7  BAV99  [SOT-23]
VD8  BAV99  [SOT-23]
VD9  BAV99  [SOT-23]
VD10  BAV99  [SOT-23]
VD11  BAV99  [SOT-23]
VD12  BAV99  [SOT-23]
VD13  BAV99  [SOT-23]
VD14  BAV99  [SOT-23]
XP1  PJ320D  [PJ320D]
XP2  XUSB-F0125  [USB_A_VERTICAL_PTH]  (value not drawn)
XP3  PJ320D  [PJ320D]
XP4  1734035-1  [MINI USB, R/A, SMT, B TYPE]
XP5  10029449-001RLF  [10029449-001RLF]
XP6  RCJ-044  [RCJ-044]
XP7  PLD-10  [PLD-10]
XP8  PLS-2  [PLS-2]
XP9  PLS-4  [PLS-4]
XP10  PBD-40 (114A-DS40G)  [PBD-40]
XP11  PBD-30 (114A-DS30G)  [PBD-30]
XP13  PJ-002BH-SMT  [PJ-002BH-SMT]
XP14  PLD-10_not_mount  [PLD-10_not_mount]
XS1  HR911105A  [HR911105A]
XS2  112J-TXAR-R  [112J-TDAR-R]

## Nets
1V5: C1.2 C2.2 C3.2 C6.2 C7.2 C8.2 C9.2 C10.2 C11.2 C14.2 C15.2 C19.2 C20.2 C21.2 C22.2 C23.2 C25.2 C37.2 C38.2 C42.2 C43.2 C44.2 C45.2 C46.2 C117.2 C118.2 DD1.M5(VCC_DRAM_1) DD1.N5(VCC_DRAM_2) DD1.T5(VCC_DRAM_3) DD1.T6(VCC_DRAM_4) DD1.T9(VCC_DRAM_5) DD1.T10(VCC_DRAM_6) DD1.T11(VCC_DRAM_7) DD3.A2(VDD) DD3.A9(VDD) DD3.B9(VDDQ) DD3.C1(VDDQ) DD3.D7(VDD) DD3.E2(VDDQ) DD3.E9(VDDQ) DD3.G2(VDD) DD3.G8(VDD) DD3.K1(VDD) DD3.K9(VDD) DD3.M1(VDD) DD3.M9(VDD) DD5.5(Vout_1V5) DD6.A2(VDD) DD6.A9(VDD) DD6.B9(VDDQ) DD6.C1(VDDQ) DD6.D7(VDD) DD6.E2(VDDQ) DD6.E9(VDDQ) DD6.G2(VDD) DD6.G8(VDD) DD6.K1(VDD) DD6.K9(VDD) DD6.M1(VDD) DD6.M9(VDD) R30.2
3V3: C12.2 C13.2 C47.2 C72.2 C74.2 C75.2 C76.2 C77.2 C79.1 C86.1 C90.1 C101.1 C102.1 C105.2 C106.2 C107.2 C108.2 C109.2 C110.2 C111.2 C112.2 C120.2 DD1.E5(VCC_1) DD1.F5(VCC_2) DD1.G16(VCC_3) DD1.H16(VCC_4) DD1.J16(VCC_5) DD1.K16(VCC_6) DD1.L16(VCC_7) DD1.P16(V33_USB) DD1.T14(V33_HP) DD2.14(DVDD33) DD2.37(ANE) DD2.38(DUPLEX) DD2.39(SPEED) DD2.41(LDPS) DD2.44(MII/SNIB) DD2.48(DVDD33) DD5.3(EN) DD8.1(EN) DD10.3(VCC) L1.2 L7.2 R3.1 R4.2 R12.1 R25.2 R32.2 R34.2 R35.2 R36.2 R37.2 R38.2 R39.2 R40.2 R43.1 R44.1 R56.1 R59.2 R65.2 R66.1 R69.2 R72.1 R74.2 R76.2 R77.2 R78.2 R80.2 VD4.1 VD5.1 VD5.2 VD7.2 VD11.2 VD12.2 VD13.2 VD14.2 XP7.1 XP9.1 XP10.8 XP11.18 XP11.30 XS1.9 XS2.4(VDD)  [also labelled 3V3_L]
5V: C81.2 C93.2 C94.2 C95.2 C96.2 C115.2 C127.2 C128.2 C129.2 C130.2 C131.2 C132.2 C133.2 C134.2 C136.2 C141.2 DD4.5(IN) DD5.1(Vin) DD8.4(VIN) DD9.1(EN) DD9.4(VIN) L12.2 R33.1 R68.2 R70.2 R87.2 R88.1 VD3.1 VD3.2 VD8.2 VD9.2 VD10.2 XP4.VBUS XP10.5 XP10.6  [also labelled 5V_OTG]
AGND: C63.2 R48.2 XP2.P1 XP2.P2 XP2.P3 XP2.P4 XP4.GND1 XP4.GND2 XP4.GND3
AVCC3V: C82.1 C122.2 DD1.T15(AVCC) L11.2
CPU_VDD: C49.1 C50.1 C51.1 C54.2 C55.2 C56.2 C57.2 C58.2 C60.1 C61.1 C65.2 C66.1 C67.1 C97.1 C98.1 C99.1 C100.1 C103.2 C104.2 DD1.E6(VDD_CPU_1) DD1.E7(VDD_CPU_2) DD1.E8(VDD_CPU_3) DD1.E9(VDD_CPU_4) DD1.E10(VDD_CPU_5) DD1.E11(VDD_CPU_6) DD1.E12(VDD_CPU_7) DD1.E13(VDD_CPU_8) DD1.E14(VDD_CPU_9) DD1.E15(VDD_CORE_1) DD1.E16(VDD_CORE_2) DD1.F16(VDD_CORE_3) DD1.H4(VDD_CORE_4) DD1.H5(VDD_CORE_5) DD1.J4(VDD_DLL_1) DD1.J5(VDD_DLL_2) DD1.M16(VDD_CORE_6) DD1.M17(VDD_CORE_7) DD1.T13(VDD_CORE_8) DD1.U13(VDD_CORE_9) L5.2 R79.2  [also labelled INT_VDD]
GND: BT1.2 C1.1 C2.1 C3.1 C4.1 C5.1 C6.1 C7.1 C8.1 C9.1 C10.1 C11.1 C12.1 C13.1 C14.1 C15.1 C16.2 C17.2 C18.2 C19.1 C20.1 C21.1 C22.1 C23.1 C24.1 C25.1 C26.1 C27.1 C28.1 C29.1 C30.1 C31.1 C32.1 C33.1 C34.1 C35.1 C36.1 C38.1 C39.1 C40.1 C41.1 C42.1 C43.1 C44.1 C45.1 C46.1 C47.1 C48.1 C49.2 C50.2 C51.2 C52.1 C53.1 C54.1 C55.1 C56.1 C57.1 C58.1 C59.2 C60.2 C61.2 C62.2 C63.1 C64.2 C65.1 C66.2 C67.2 C68.2 C69.2 C70.2 C72.1 C73.1 C74.1 C75.1 C76.1 C77.1 C79.2 C81.1 C82.2 C83.1 C84.1 C85.2 C86.2 C89.2 C90.2 C91.1 C92.1 C93.1 C94.1 C95.1 C96.1 C98.2 C99.2 C100.2 C102.2 C103.1 C104.1 C105.1 C106.1 C107.1 C108.1 C109.1 C110.1 C111.1 C112.1 C115.1 C117.1 C118.1 C120.1 C121.1 C122.1 C123.1 C124.1 C125.1 C126.1 C127.1 C128.1 C129.1 C130.1 C131.1 C132.1 C133.1 C134.1 C136.1 C138.1 C139.1 C140.1 C141.1 C142.1 C143.1 DD1.D4(TEST) DD1.G5(VDD_EFUSE) DD1.H8(GND_1) DD1.H9(GND_2) DD1.H10(GND_3) DD1.H11(GND_4) DD1.H12(GND_5) DD1.H13(GND_6) DD1.J8(GND_7) DD1.J9(GND_8) DD1.J10(GND_9) DD1.J11(GND_10) DD1.J12(GND_11) DD1.J13(GND_12) DD1.K4(GND_DLL_1) DD1.K5(GND_DLL_2) DD1.K8(GND_13) DD1.K9(GND_14) DD1.K10(GND_15) DD1.K11(GND_16) DD1.K12(GND_17) DD1.K13(GND_18) DD1.L5(GND_DRAM_1) DD1.L8(GND_19) DD1.L9(GND_20) DD1.L10(GND_21) DD1.L11(GND_22) DD1.L12(GND_23) DD1.L13(GND_24) DD1.M8(GND_25) DD1.M9(GND_26) DD1.M10(GND_27) DD1.M11(GND_28) DD1.M12(GND_29) DD1.M13(GND_30) DD1.N8(GND_31) DD1.N9(GND_32) DD1.N10(GND_33) DD1.N11(GND_34) DD1.N12(GND_35) DD1.N13(GND_36) DD1.N16(GND_USB) DD1.P5(GND_DRAM_2) DD1.R5(GND_DRAM_3) DD1.T7(GND_DRAM_4) DD1.T8(GND_DRAM_5) DD1.T12(GND_DRAM_6) DD1.U12(GND_DRAM_7) DD1.U15(GND_HP) DD1.U16(AGND) DD1.V19(GND_37) DD2.11(DGND) DD2.17(DGND) DD2.29(AGND) DD2.35(AGND) DD2.40(RPTR) DD2.43(ISOLATE) DD2.45(DGND) DD3.A1(VSS) DD3.A8(VSS) DD3.B1(VSS) DD3.B2(VSSQ) DD3.B8(VSSQ) DD3.C9(VSSQ) DD3.D1(VSSQ) DD3.D8(VSS) DD3.D9(VSSQ) DD3.F2(VSS) DD3.F8(VSS) DD3.J1(VSS) DD3.J9(VSS) DD3.L1(VSS) DD3.L9(VSS) DD3.N1(VSS) DD3.N9(VSS) DD4.2(GND) DD5.2(GND) DD6.A1(VSS) DD6.A8(VSS) DD6.B1(VSS) DD6.B2(VSSQ) DD6.B8(VSSQ) DD6.C9(VSSQ) DD6.D1(VSSQ) DD6.D8(VSS) DD6.D9(VSSQ) DD6.F2(VSS) DD6.F8(VSS) DD6.J1(VSS) DD6.J9(VSS) DD6.L1(VSS) DD6.L9(VSS) DD6.N1(VSS) DD6.N9(VSS) DD7.4(VSS) DD8.2(GND) DD9.2(GND) DD10.1(GND) DD11.1(PGND) DD11.3(AGND) LED1.1(K) LED2.1(K) R5.2 R6.2 R8.2 R10.1 R11.2 R16.1 R17.1 R18.1 R24.2 R28.2 R29.1 R31.2 R45.1 R46.1 R48.1 R49.1 R53.2 R57.1 R58.1 R60.1 R61.1 R71.1 R81.1 R82.1 R90.1 VD1.38(GND) VD2.38(GND) VD6.2 VD7.1 VD8.1 VD9.1 VD10.1 VD11.1 VD12.1 VD13.1 VD14.1 XP2.4 XP3.2 XP3.5 XP4.GND XP5.2 XP5.5 XP5.8 XP5.11 XP5.17 XP5.P1 XP5.P2 XP5.P3 XP5.P4 XP6.1 XP7.2 XP8.1 XP9.4 XP10.3 XP10.4 XP10.7 XP10.15 XP10.21 XP11.5 XP11.6 XP11.24 XP11.27 XP13.2(-) XP14.2 XS1.11 XS2.6(VSS) XS2.11(S) XS2.12(S) XS2.13(S)
VIN12V: C91.2 C92.2 C123.2 C124.2 C125.2 C140.2 DD11.2(Vin) R85.2 VD6.1 XP10.1 XP10.2 XP13.1(+)  [also labelled 12V]
5VHDMI: C142.2 VD3.3 XP5.18
5VUSB: C52.2 C53.2 DD4.1(OUT) R33.2 XP2.1
BA0: DD1.U6(SBA0/DDR2_BA2/DDR3_BA0) DD3.J2(BA0) DD6.J2(BA0)
BA1: DD1.N3(SBA1/DDR2_CS0/DDR3_BA1) DD3.K8(BA1) DD6.K8(BA1)
BA2: DD1.V6(SBA2/DDR2_WE/DDR3_BA2) DD3.J3(BA2) DD6.J3(BA2)
CAS: DD1.V4(SCAS/DDR2_A13/DDR3_CAS) DD3.G3(#CAS) DD6.G3(#CAS)
CKE0: DD1.L3(SCKE0/DDR2_ODT0/DDR3_CKE0) DD3.G9(CKE) DD6.G9(CKE)
CKE1: DD1.U5(SCKE1/DDR2_CKE1/DDR3_CKE1) DD3.F9(NC/CKE1) DD6.F9(NC/CKE1)
CLK_N: DD3.G7(#CK) DD6.G7(#CK) R9.1
CLK_P: DD3.F7(CK) DD6.F7(CK) R7.1
CLKR_N: DD1.Y1(SCK_N/DDR2_CK_N/DDR3_CK_N) R9.2
CLKR_P: DD1.W2(SCK/DDR2_CK/DDR3_CK) R7.2
CVREF: C29.2 C30.2 C31.2 C33.2 C34.2 C35.2 C36.2 C37.1 DD1.L4(SVREF0) DD1.U11(SVREF1) DD3.E1(VREFDQ) DD3.J8(VREFCA) DD6.E1(VREFDQ) DD6.J8(VREFCA) R29.2 R30.1  [also labelled DDR3_VREF]
D0: DD1.J1(SDQ6/DDR2_D3/DDR3_D6) DD3.B3(DQ0)
D1: DD1.U2(SDQ1/DDR2_D7/DDR3_D1) DD3.C7(DQ1)
D2: DD1.J2(SDQ2/DDR2_D1/DDR3_D2) DD3.C2(DQ2)
D3: DD1.V1(SDQ3/DDR2_D0/DDR3_D3) DD3.C8(DQ3)
D4: DD1.K1(SDQ0/DDR2_D6/DDR3_D0) DD3.E3(DQ4)
D5: DD1.W1(SDQ5/DDR2_D5/DDR3_D5) DD3.E8(DQ5)
D6: DD1.J3(SDQ4/DDR2_D4/DDR3_D4) DD3.D2(DQ6)
D7: DD1.V2(SDQ7/DDR2_D2/DDR3_D7) DD3.E7(DQ7)
D8: DD1.L1(SDQ13/DDR2_D9/DDR3_D13) DD6.B3(DQ0)
D9: DD1.U1(SDQ10/DDR2_D13/DDR3_D10) DD6.C7(DQ1)
D10: DD1.K2(SDQ11/DDR2_D12/DDR3_D11) DD6.C2(DQ2)
D11: DD1.T2(SDQ14/DDR2_D10/DDR3_D14) DD6.C8(DQ3)
D12: DD1.M1(SDQ9/DDR2_D11/DDR3_D9) DD6.E3(DQ4)
D13: DD1.R2(SDQ12/DDR2_D15/DDR3_D12) DD6.E8(DQ5)
D14: DD1.L2(SDQ15/DDR2_D14/DDR3_D15) DD6.D2(DQ6)
D15: DD1.T1(SDQ8/DDR2_D8/DDR3_D8) DD6.E7(DQ7)
DDR3_CS0: DD1.V5(SCS0/DDR2_CS0/DDR3_CS0) DD3.H2(#CS) DD6.H2(#CS)
DDR3_CS1: DD1.N4(SCS1/DDR2_CS1/DDR3_CS1) DD3.H1(NC/#CS1) DD6.H1(NC/#CS1)
DDR3_RST: DD1.U10(SRST/DDR2_A9/DDR3_RST) DD3.N2(#RESET) DD6.N2(#RESET)
DQM0: DD1.P1(SDQM0/DDR2_DM0/DDR3_DM0) DD3.B7(DM/TDQS)
DQM1: DD1.M2(SDQM1/DDR2_DM1/DDR3_DM1) DD6.B7(DM/TDQS)
DQS0_N: DD1.N2(SDQS0_N/DDR2_DQS0_N/DDR3_DQS0_N) DD3.D3(#DQS)
DQS0_P: DD1.N1(SDQS0/DDR2_DQS0/DDR3_DQS0) DD3.C3(DQS)
DQS1_N: DD1.R1(SDQS1_N/DDR2_DQS1_N/DDR3_DQS1_N) DD6.D3(#DQS)
DQS1_P: DD1.P2(SDQS1/DDR2_DQS1/DDR3_DQS1) DD6.C3(DQS)
ECOL: DD1.D14(PA16/ECOL/UART2_TX) DD2.1(COL) R25.1
ECRS: DD1.C13(PA15/ECRS/UART1_RTS/UART3_RX/KP_OUT7) DD2.23(CRS) R31.1
EMDC: DD1.C12(PA11/EMDC/TS_D7/UART1_RING/KP_OUT3) DD2.25(MDC)
EMDIO: DD1.D13(PA12/EMDIO/UART1_TX/KP_OUT4) DD2.26(MDIO) R3.2
EPHY-RST#: DD1.C14(PA17/ETXERR/UART2_RX/EINT31) R13.1
ERXCK: DD1.D10(PA8/ERXCK/TS_D4/UART1_DTR/KP_OUT0) DD2.16(RXC)
ERXD0: DD1.C7(PA3/ERXD0/TS_DVLD/KP_IN3) DD2.21(RXD0)
ERXD1: DD1.D7(PA2/ERXD1/TS_SYNC/KP_IN2) DD2.20(RXD1)
ERXD2: DD1.C6(PA1/ERXD2/TS_ERR/KP_IN1) DD2.19(RXD2)
ERXD3: DD1.D6(PA0/ERXD3/TS_CLK/KP_IN0) DD2.18(RXD3)
ERXDV: DD1.D11(PA10/ERXDV/TS_D6/UART1_DCD/KP_OUT2) DD2.22(RXDV)
ERXERR: DD1.C10(PA9/ERXERR/TS_D5/UART1_DSR/KP_OUT1) DD2.24(RXER/FXEN) R28.1
ETXCK: DD1.D12(PA14/ETXCK/UART1_CTS/UART3_TX/KP_OUT6) DD2.7(TXC)
ETXD0: DD1.C9(PA7/ETXD0/TS_D3/KP_IN7) DD2.6(TXD0)
ETXD1: DD1.D9(PA6/ETXD1/TS_D2/KP_IN6) DD2.5(TXD1)
ETXD2: DD1.C8(PA5/ETXD2/TS_D1/KP_IN5) DD2.4(TXD2)
ETXD3: DD1.D8(PA4/ETXD3/TS_DO/KP_IN4) DD2.3(TXD3)
ETXEN: DD1.C11(PA13/ETXEN/UART1_RX/KP_OUT5) DD2.2(TXEN)
FBIN: C28.2 DD2.8(PWFBIN) L2.2
FBOUT: C18.1 C24.2 C26.2 C27.2 DD2.32(PWFBOUT) L2.1 XS1.4 XS1.5
FMINL: DD1.W16(FMINL) XP10.14
FMINR: DD1.V16(FMINR) XP10.16
HCEC: DD1.R17(HCEC) VD11.3 XP5.13
HHPD: C143.2 DD1.T17(HHPD) R14.2
HPCOM: DD1.V13(HPCOMFB) DD1.W13(HPCOM) R50.2 VD14.3 XP1.2 XP1.5  [also labelled HPCOM-FB]
HPD: R14.1 R71.2 VD10.3 XP5.19
HPL: DD1.Y13(HPOUTL) R51.2 VD13.3 XP1.4
HPR: DD1.Y14(HPOUTR) R52.2 VD12.3 XP1.3
HSCL: DD1.R18(HSCL) R68.1 VD8.3 XP5.15
HSDA: DD1.T18(HSDA) R70.1 VD9.3 XP5.16
HTX0_N: DD1.R19(HTX0N) VD2.2(IN2) XP5.9
HTX0_P: DD1.R20(HTX0P) VD2.1(IN1) XP5.7
HTX1_N: DD1.P19(HTX1N) VD1.5(IN4) XP5.6
HTX1_P: DD1.P20(HTX1P) VD1.4(IN3) XP5.4
HTX2_N: DD1.N19(HTX2N) VD1.2(IN2) XP5.3
HTX2_P: DD1.N20(HTX2P) VD1.1(IN1) XP5.1
HTXC_N: DD1.T19(HTXCN) VD2.5(IN4) XP5.12
HTXC_P: DD1.T20(HTXCP) VD2.4(IN3) XP5.10
JTAG_SEL0_N: DD1.M20(JTAG_SEL0_N) R43.2
JTAG_SEL1_N: DD1.M19(JTAG_SEL1_N) R44.2
LED0: DD1.A20(PD15/LCD_D15/ERXERR) R73.2
LINEINL: C80.2 DD1.U17(LINEINL)
LINEINR: C78.2 DD1.V18(LINEINR)
LRADC0: DD1.Y17(LRADC0) XP10.13
LRADC1: DD1.Y18(LRADC1) XP10.11
MIC_IN_1: C87.2 R62.2 XP10.10
MIC_IN_2: C88.2 XP10.9
MICIN1: C87.1 DD1.Y15(MICIN1) R60.2
MICIN2: C88.1 DD1.W15(MICIN2) R61.2
ODT0: DD1.V11(SODT0/DDR2_A12/DDR3_ODT0) DD3.G1(ODT) DD6.G1(ODT)
ODT1: DD1.M4(SODT1/DDR2_ODT1/DDR3_ODT1) DD3.F1(NC/ODT1) DD6.F1(NC/ODT1)
PB0/TWI0_SCK: DD1.L20(PB0/TWI0_SCK) DD7.6(SCL) R76.1 XP10.22
PB1/TWI0_SDA: DD1.L19(PB1/TWI0_SDA) DD7.5(SDA) R78.1 XP10.23
PB2/PWM0: DD1.K20(PB2/PWM0/EINT16) XP10.24
PB3/IR_TX: DD1.A14(PB3/IR_TX/EINT17) XP11.19
PB4/IR_RX: DD1.K19(PB4/IR_RX/EINT18) XP11.21
PB5/I2S_MCLK: DD1.D2(PB5/I2S_MCLK/EINT19) XP14.9
PB6/I2S_BCLK: DD1.E1(PB6/I2S_BCLK/EINT20) XP14.7
PB7/I2S_LRCK: DD1.E2(PB7/I2S_LRCK/EINT21) XP14.10
PB8/I2S_DO: DD1.F1(PB8/I2S_DO/EINT22) XP14.5
PB9/I2S_DI: DD1.F2(PB9/I2S_DI/EINT23) XP14.8
PB10/SPI2_CS1: DD1.D3(PB10/SPI2_CS1/EINT24) XP14.6
PB11/SPI2_CS0/JTAG_MS0: DD1.E3(PB11/SPI2_CS0/JTAG_MS0/EINT25) XP7.10
PB12/SPI2_CLK/JTAG_CK0: DD1.E4(PB12/SPI2_CLK/JTAG_CK0/EINT26) XP7.9
PB13/SPI2_MOSI/JTAG_DO0: DD1.F3(PB13/SPI2_MOSI/JTAG_DO0/EINT27) XP7.8
PB14/SPI2_MISO/JTAG_DI0: DD1.F4(PB14/SPI2_MISO/JTAG_DI0/EINT28) XP7.7
PB15/TWI1_SCK: DD1.J20(PB15/TWI1_SCK) R66.2 XP10.25
PB16/TWI1_SDA: DD1.J19(PB16/TWI1_SDA) R65.1 XP10.26
PB17/TWI2_SCK: DD1.A7(PB17/TWI2_SCK) R69.1 XP7.5
PB18/TWI2_SDA: DD1.B8(PB18/TWI2_SDA) R72.2 XP7.6
PB19/UART0_TX: DD1.G3(PB19/UART0_TX/EINT29) R15.2
PB20/UART0_RX: DD1.G4(PB20/UART0_RX/EINT30) R19.2
PC0/SPI0_MOSI: DD1.D1(PC0/NWE/SPI0_MOSI) XP11.8
PC1/SPI0_MISO: DD1.C3(PC1/NALE/SPI0_MISO) XP11.9
PC2/SPI0_CLK: DD1.C2(PC2/NCLE/SPI0_CLK) XP11.10
PC3/SPI0_CS0: DD1.C1(PC3/NCE1/SPI0_CS0) XP11.7
PC5/SDC2_SDET#: DD1.B1(PC5/NRE) XP11.11
PC6/SDC2_CMD: DD1.A1(PC6/NRB0/SDC2_CMD) XP11.12
PC7/SDC2_CLK: DD1.A2(PC7/NRB1/SDC2_CLK) XP11.14
PC8/SDC2_D0: DD1.B3(PC8/NDQ0/SDC2_D0) XP11.15
PC9/SDC2_D1: DD1.A3(PC9/NDQ1/SDC2_D1) XP11.16
PC10/SDC2_D2: DD1.C4(PC10/NDQ2/SDC2_D2) XP11.13
PC11/SDC2_D3: DD1.B4(PC11/NDQ3/SDC2_D3) XP11.17
PC16/UART3_TX: DD1.A5(PC16/NWP/UART3_TX) XP14.3
PC17UART3_RX: DD1.B6(PC17/NCE2/UART3_RX) XP14.4
PC18/UART2_TX/UART3_CTS: DD1.A6(PC18/NCE3/UART2_TX/UART3_CTS) R27.2
PC19/UART2_RX/UART3_RTS: DD1.B7(PC19/NDQS/UART2_RX/UART3_RTS) R26.1
PD2/UART2_TX: DD1.B15(PD2/LCD_D2/UART2_TX) R55.2
PD3/UART2_RX: DD1.A15(PD3/LCD_D3/UART2_RX) R83.2
PD4/UART2_CTS: DD1.D16(PD4/LCD_D4/UART2_CTS) XP11.28
PD5/UART2_RTS: DD1.C16(PD5/LCD_D5/UART2_RTS) XP11.26
PE0/TS_CLK/CSI_PCLK/SPI2_CS0: DD1.H20(PE0/TS_CLK/CSI_PCLK/SPI2_CS0/EINT14) XP10.27
PE1/TS_ERR/CSI_MCLK/SPI2_CLK: DD1.H19(PE1/TS_ERR/CSI_MCLK/SPI2_CLK/EINT15) XP10.28
PE2/TS_SYNC/CSI_HSYNC/SPI2_MOSI: DD1.G20(PE2/TS_SYNC/CSI_HSYNC/SPI2_MOSI) XP10.29
PE3/TS_DVLD/CSI_VSYNC/SPI2_MISO: DD1.G19(PE3/TS_DVLD/CSI_VSYNC/SPI2_MISO) XP10.30
PE4/TS_D0/CSI_D0/SDC2_DO: DD1.F20(PE4/TS_D0/CSI_D0/SDC2_DO) XP10.31
PE5/TS_D1/CSI_D1/SDC2_D1: DD1.F19(PE5/TS_D1/CSI_D1/SDC2_D1) XP10.32
PE6/TS_D2/CSI_D2/SDC2_D2: DD1.E20(PE6/TS_D2/CSI_D2/SDC2_D2) XP10.33
PE7/TS_D3/CSI_D3/SDC2_D3: DD1.E19(PE7/TS_D3/CSI_D3/SDC2_D3) XP10.34
PE8/TS_D4/CSI_D4/SDC2_CMD: DD1.D20(PE8/TS_D4/CSI_D4/SDC2_CMD) XP10.35
PE9/TS_D5/CSI_D5/SDC2_CLK: DD1.D19(PE9/TS_D5/CSI_D5/SDC2_CLK) XP10.36
PE10/TS_D6/CSI_D6: DD1.C20(PE10/TS_D6/CSI_D6/UART1_TX) XP10.37
PE11/TS_D7/CSI_D7: DD1.C19(PE11/TS_D7/CSI_D7/UART1_RX) XP10.38
PG3/UART1_TX: DD1.A11(PG3/SDC1_CMD/UART1_TX/EINT3) R47.1
PG4/UART1_RX: DD1.B12(PG4/SDC1_CLK/UART1_RX/EINT4) R54.1
PG9/UART3_TX: DD1.G1(PG9/SPI1_CS0/UART3_TX/EINT9) R41.1
PG10/UART3_RX: DD1.G2(PG10/SPI1_CLK/UART3_RX/EINT10) R42.1
PG_5V: DD11.7(PG)
PHYAD0/LED0: DD2.9(LED0/PHYAD0) R2.1 R4.1
PHYAD1/LED1: DD2.10(LED1/PHYAD1) R5.1
PHYAD2/LED2: DD2.12(LED2/PHYAD2) R6.1
PHYAD3/LED3: DD2.13(LED3/PHYAD3) R1.1 R8.1
PHYAD4/LED4: DD2.15(LED4/PHYAD4) R11.1
RAS: DD1.U4(SRAS/DDR2_A11/DDR3_RAS) DD3.F3(#RAS) DD6.F3(#RAS)
RECOVERY: BT1.1 DD1.B20(PD17/LCD_D17) R74.1
RESET_N: DD1.A8(RESET_N) R67.2 XP14.1
RTC_CLK_OUT: DD7.7(CLKOUT) R93.2 XP10.39
RTC_~{INT}: DD7.3(INT) R75.2 XP10.40
SA0: DD1.V7(SA0/DDR2_BA1/DDR3_A0) DD3.K3(A0) DD6.K3(A0)
SA1: DD1.R4(SA1/DDR2_A2/DDR3_A1) DD3.L7(A1) DD6.L7(A1)
SA2: DD1.U8(SA2/DDR2_A1/DDR3_A2) DD3.L3(A2) DD6.L3(A2)
SA3: DD1.U7(SA3/DDR2_BA0/DDR3_A3) DD3.K2(A3) DD6.K2(A3)
SA4: DD1.P3(SA4/DDR2_A0/DDR3_A4) DD3.L8(A4) DD6.L8(A4)
SA5: DD1.V8(SA5/DDR2_A10/DDR3_A5) DD3.L2(A5) DD6.L2(A5)
SA6: DD1.R3(SA6/DDR2_A4/DDR3_A6) DD3.M8(A6) DD6.M8(A6)
SA7: DD1.V10(SA7/DDR2_A7/DDR3_A7) DD3.M2(A7) DD6.M2(A7)
SA8: DD1.T3(SA8/DDR2_A6/DDR3_A8) DD3.N8(A8) DD6.N8(A8)
SA9: DD1.V9(SA9/DDR2_A3/DDR3_A9) DD3.M3(A9) DD6.M3(A9)
SA10: DD1.M3(SA10/DDR2_RAS/DDR3_A10) DD3.H7(A10/AP) DD6.H7(A10/AP)
SA11: DD1.T4(SA11/DDR2_A8/DDR3_A11) DD3.M7(A11) DD6.M7(A11)
SA12: DD1.P4(SA12/DDR2_CAS/DDR3_A12) DD3.K7(A12/#BC) DD6.K7(A12/#BC)
SA13: DD1.U9(SA13/DDR2_A5/DDR3_A13) DD3.N3(A13) DD6.N3(A13)
SA14: DD1.U3(SA14/DDR2_A14/DDR3_A14) DD3.N7(A14) DD6.N7(A14)
SD0-CLK: DD1.K18(PF2/SDC0_CLK/UART0_TX) XS2.5(CLK)
SD0-CMD: DD1.K17(PF3/SDC0_CMD/JTAG_DO1) R38.1 XS2.3(CMD/MOSI)
SD0-D0: DD1.L17(PF1/SDC0_D0/JTAG_DI1) R37.1 XS2.7(DAT0/MISO)
SD0-D1: DD1.L18(PF0/SDC0_D1/JTAG_MS1) R36.1 XS2.8(DAT1)
SD0-D2: DD1.J17(PF5/SDC0_D2/JTAG_CK1) R40.1 XS2.1(DTA2)
SD0-D3: DD1.J18(PF4/SDC0_D3/UART0_RX) R39.1 XS2.2(DAT3/CS)
SD0-DET#: DD1.A10(PG1/GPS_SIGN/EINT1) R35.1 XS2.9(CD)
TPRX_N: DD2.30(TPRX-) R23.2 XS1.6
TPRX_P: DD2.31(TPRX+) R22.2 XS1.3
TPTX_N: DD2.33(TPTX-) R21.2 XS1.2
TPTX_P: DD2.34(TPTX+) R20.2 XS1.1
TPX1: DD1.Y20(TPX1) XP10.18
TPX2: DD1.Y19(TPX2) XP10.17
TPY1: DD1.W20(TPY1) XP10.20
TPY2: DD1.W19(TPY2) XP10.19
TVOUT: DD1.M18(TVOUT) R64.1 VD7.3
UART0_RX: R19.1 XP9.3 XP11.3
UART0_TX: R15.1 XP9.2 XP11.1
UART1_RX_: R54.2 XP11.22
UART1_TX_: R47.2 XP11.20
UART2_RX: R26.2 XP7.4
UART2_RX_: R83.1 XP11.25
UART2_TX: R27.1 XP7.3
UART2_TX_: R55.1 XP11.23
UART3_RX_: R42.2 XP11.4
UART3_TX_: R41.2 XP11.2
UBOOT_N: DD1.A9(UBOOT_N) R32.1
UD0_N: DD1.P18(UDM0) XP4.D-
UD0_P: DD1.P17(UDP0) XP4.D+
UD1_N: DD1.N18(UDM1) XP2.2
UD1_P: DD1.N17(UDP1) XP2.3
USB0_DET#: DD1.H2(PG12/SPI1_MISO/UART3_RTS/EINT12) R59.1 XP4.ID
USB1-DRV: DD1.C15(PD1/LCD_D1) DD4.4(EN) R45.2
VBAT_RTC_3V: VD4.2 XP8.2
VDD_HDMI: C83.2 C84.2 DD1.R16(V33_HDMI) R56.2
VDD_RTC: C73.2 DD7.8(VDD) R75.1 R93.1 VD4.3
VMIC: DD1.Y16(VMIC) R63.2 XP10.12
VRA1: C59.1 DD1.V15(VRA1)
VRA2: C62.1 DD1.V14(VRA2) R49.2
VRP: C64.1 DD1.W14(VRP)
WE: DD1.V3(SWE/DDR2_CKE0/DDR3_WE) DD3.H3(#WE) DD6.H3(#WE)
NetBQ1_1: BQ1.1 C16.1 DD2.46(X1)
NetBQ1_2: BQ1.2 C17.1 DD2.47(X2)
NetBQ2_1: BQ2.1 C48.2 DD1.V20(X24MOUT)
NetBQ2_2: BQ2.2 C41.2 DD1.U20(X24MIN)
NetBQ3_1: BQ3.1 DD7.2(OSCO)
NetBQ3_2: BQ3.2 DD7.1(OCSI)
NetC4_2: C4.2 C5.2 DD2.36(AVDD33) L1.1
NetC32_2: C32.2 DD2.42(RESETB) R12.2 R13.2
NetC39_2: C39.2 R20.1 R21.1
NetC40_2: C40.2 R22.1 R23.1
NetC68_1: C68.1 R50.1
NetC69_1: C69.1 R51.1
NetC70_1: C70.1 R52.1
NetC78_1: C78.1 R57.2 XP3.3
NetC80_1: C80.1 R58.2 XP3.4
NetC85_1: C85.1 DD1.T16(V33_PLL)
NetC89_1: C89.1 R62.1 R63.1
NetC97_2: C97.2 DD8.5(FB) R79.1 R81.2
NetC101_2: C101.2 DD9.5(FB) R80.1 R82.2
NetC121_2: C121.2 L11.1 VD5.3
NetC126_2: C126.2 DD11.6(EN) R85.1
NetC137_1: C137.1 R88.2
NetC137_2: C137.2 DD11.4(FB) R87.1 R90.2
NetC138_2: C138.2 DD11.5(COMP) R92.2
NetC139_2: C139.2 R92.1
NetDD1_B9: DD1.B9(NMI_N) R34.1
NetDD1_K3: DD1.K3(SZQ) R16.2
NetDD2_28: DD2.28(RTSET) R10.2
NetDD3_H8: DD3.H8(ZQ) R17.2
NetDD4_3: DD4.3(ISET) R46.2
NetDD6_H8: DD6.H8(ZQ) R18.2
NetDD8_3: DD8.3(LX) L5.1
NetDD9_3: DD9.3(LX) L7.1
NetDD10_2: DD10.2(RESET) R67.1
NetDD11_8: DD11.8(Vsw) L12.1
NetLED1_2: LED1.2(A) R73.1
NetLED2_2: LED2.2(A) R77.1
NetR1_2: R1.2 XS1.12
NetR2_2: R2.2 XS1.10
NetR24_1: R24.1 XS1.8(SHIELD)
NetR53_1: R53.1 XS2.10(G)
NetR64_2: R64.2 XP6.2

Not connected (* = marked no-connect by the designer): DD1 A4(PC12/NDQ4/SDC2_D4) A12(PG5/SDC1_D0/UART1_CTS/EINT5) A13(PG7/SDC1_D2/UART2_TX/EINT7) A16(PD7/LCD_D7/ECOL) A17(PD10/LCD_D10/ERXDO) A18(PD13/LCD_D13/ERXD3) A19(PD14/LCD_D14/ERXCK) B2(PC4/NCE0) B5(PC15/NDQ7/SDC2_D7) B10(PG0/GPS_CLK/EINT0) B11(PG2/GPS_MAG/EINT2) B13(PG6/SDC1_D1/UART1_RTS/UART2_RTS/EINT6) B14(PG8/SDC1_D3/UART2_RX/EINT8) B16(PD6/LCD_D6/ECRS) B17(PD9/LCD_D9) B18(PD12/LCD_D12/ERXD2) B19(PD16/LCD_D16) C5(PC14/NDQ6/SDC2_D6) C17(PD8/LCD_D8) C18(PD11/LCD_D11/ERXD1) D5(PC13/NDQ5/SDC2_D5) D15(PD0/LCD_D0) D17(PD18/LCD_D18/ERXDV) D18(PD19/LCD_D19/ETXD0) E17(PD20/LCD_D20/ETXD1) E18(PD21/LCD_D21/ETXD2) F17(PD22/LCD_D22/ETXD3) F18(PD23/LCD_D23/ETXEN) G17(PD24/LCD_CLK/ETXCK) G18(PD25/LCD_DE/ETXERR) H1(PG11/SPI1_MOSI/UART3_CTS/EINT11) H3(PG13/SPI1_CS1/PWM1/UART2_CTS/EINT13) H17(PD26/LCD_HSYNC/EMDC) H18(PD27/LCD_VSYNC/EMDIO) U14(HPBP) U18(HVREG1) U19(HVREG2) V12(SDQ19/DDR2_D16) V17(PLLTEST) W3(SDQ22/DDR3_D22) W4(SDQ16/DDR2_D22) W5(SDQ29/DDR2_D25) W6(SDQ25/DDR2_D27) W7(SDQS2/DDR2_DQS2/DDR3_DQS2) W8(SDQM2/DDR2_DM2/DDR3_DM2) W9(SDQS3/DDR2_DQS3/DDR3_DQS3) W10(SDQ28/DDR2_D31) W11(SDQ30/DDR2_D26) W12(SDQ21/DDR2_D21) W17(MIC1OUTP) W18(MIC1OUTN) Y2(SDQ20/DDR2_D20) Y3(SDQ18/DDR2_D17) Y4(SDQ27/DDR2_D28) Y5(SDQ31/DDR2_D30) Y6(SDQM3/DDR2_DM3/DDR3_DM3) Y7(SDQS2_N/DDR2_DQS2_N/DDR3_DQS2_N) Y8(SDQ24/DDR2_D24) Y9(SDQS3_N/DDR2_DQS3_N/DDR3_DQS3_N) Y10(SDQ26/DDR2_D29) Y11(SDQ17/DDR2_D23) Y12(SDQ23/DDR2_D18); DD2 27(NC); DD3 A3(NC) A7(NF/#TDQS) H9(NC/ZQ1) J7(NC); DD5 4(NC); DD6 A3(NC) A7(NF/#TDQS) H9(NC/ZQ1) J7(NC); XP4 GND4; XP5 14; XP11 29; XP13 3(C); XS1 113 114 115 116 117 118 119 120 121

## Layout directives
differential pair: CLK_N, CLK_P, CLKR_N, CLKR_P, DQS0_N, DQS0_P, DQS1_N, DQS1_P, HTX0_N, HTX0_P, HTX1_N, HTX1_P, HTX2_N, HTX2_P, HTXC_N, HTXC_P, TPRX_N, TPRX_P, TPTX_N, TPTX_P, UD0_N, UD0_P, UD1_N, UD1_P

## Notes on the sheet
- (near DD1) PORTS
- ETHERNET
- DDR3
- SYSTEM
- POWER A10S
- System connector the memory card
- Universal Serial Bus
- 3.5 mm audio jacks
- MicroSD
- USB HOST
- AUDIO OUT
- LINE IN
- USB OTG
- Composite video connector
- test LED
- High Definition Media Interface  HDMI
- power supply
- 3V3 for IO
- 3V for Analog
- Buttons RECOVERY
- Real-time clock (RTC)
- CPUVDD/INTVDD
- SUPERVISOR
- 1V5 for DDR3
- (near XP10) Ports ANALOG IN/TWI0,1/CSI/TS/SDC2/RTC_CLK
- Ports UART0,1,2,3/SPI0/SDC2/IR
- (near XP7) UART2/TWI2/SPI2 (UEXT)
- (near XP14) RESET/UART3/I2S  (conector not mount)
- IN 6...18V OUT 5V
- Title
- Size:
- Date:
- A0
- Revision:
- (in symbol HR911105A) YELLOW; RIGHT; GREEN; LEFT; TRANSMIT 1:1; TX+; PWR; TX-; RECEIVE 1:1; RX+; RX-; 75; 7; 1000pF 2KV
- (in symbol PJ320D) R; L
- (in symbol RCJ-044) RCA